# EAGLE board EXCISS Mainboard (EAGLE 7.7.0)
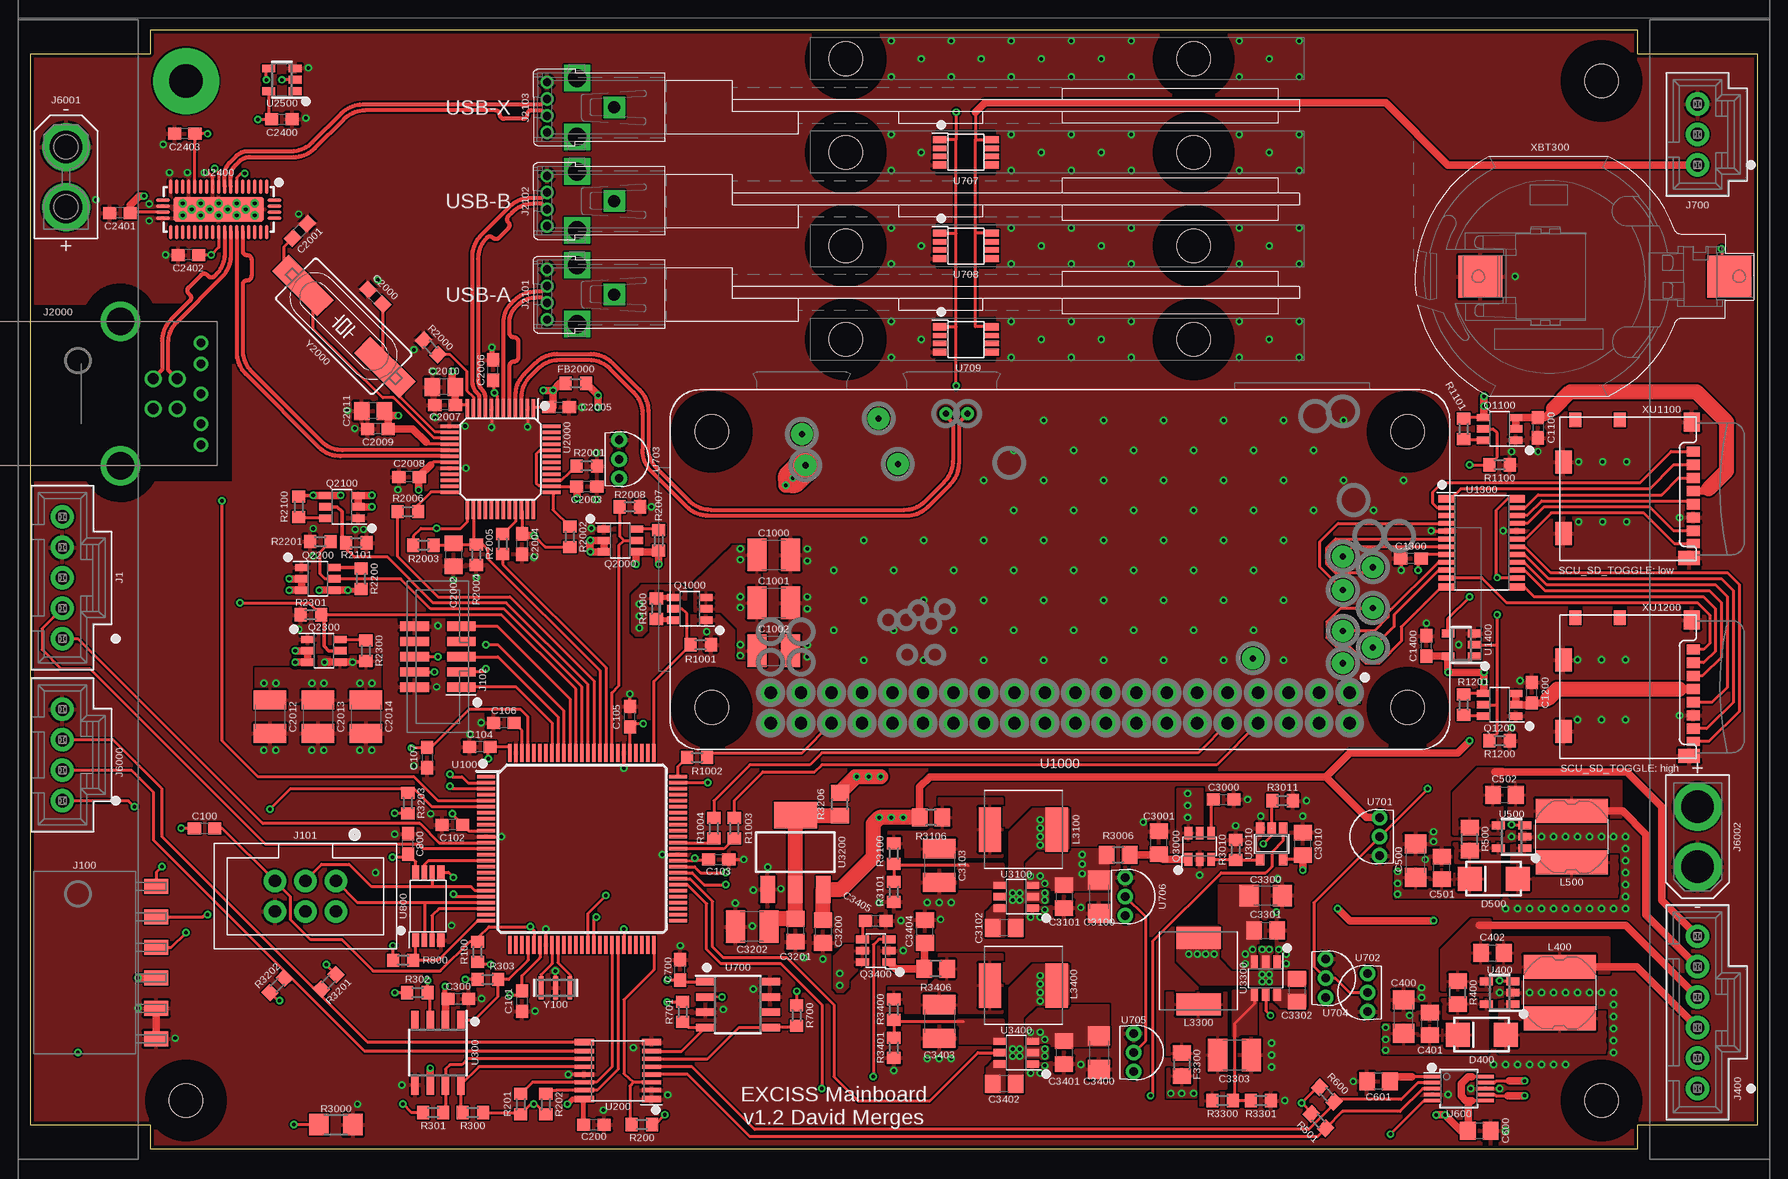
[diagram p5: board, top side]
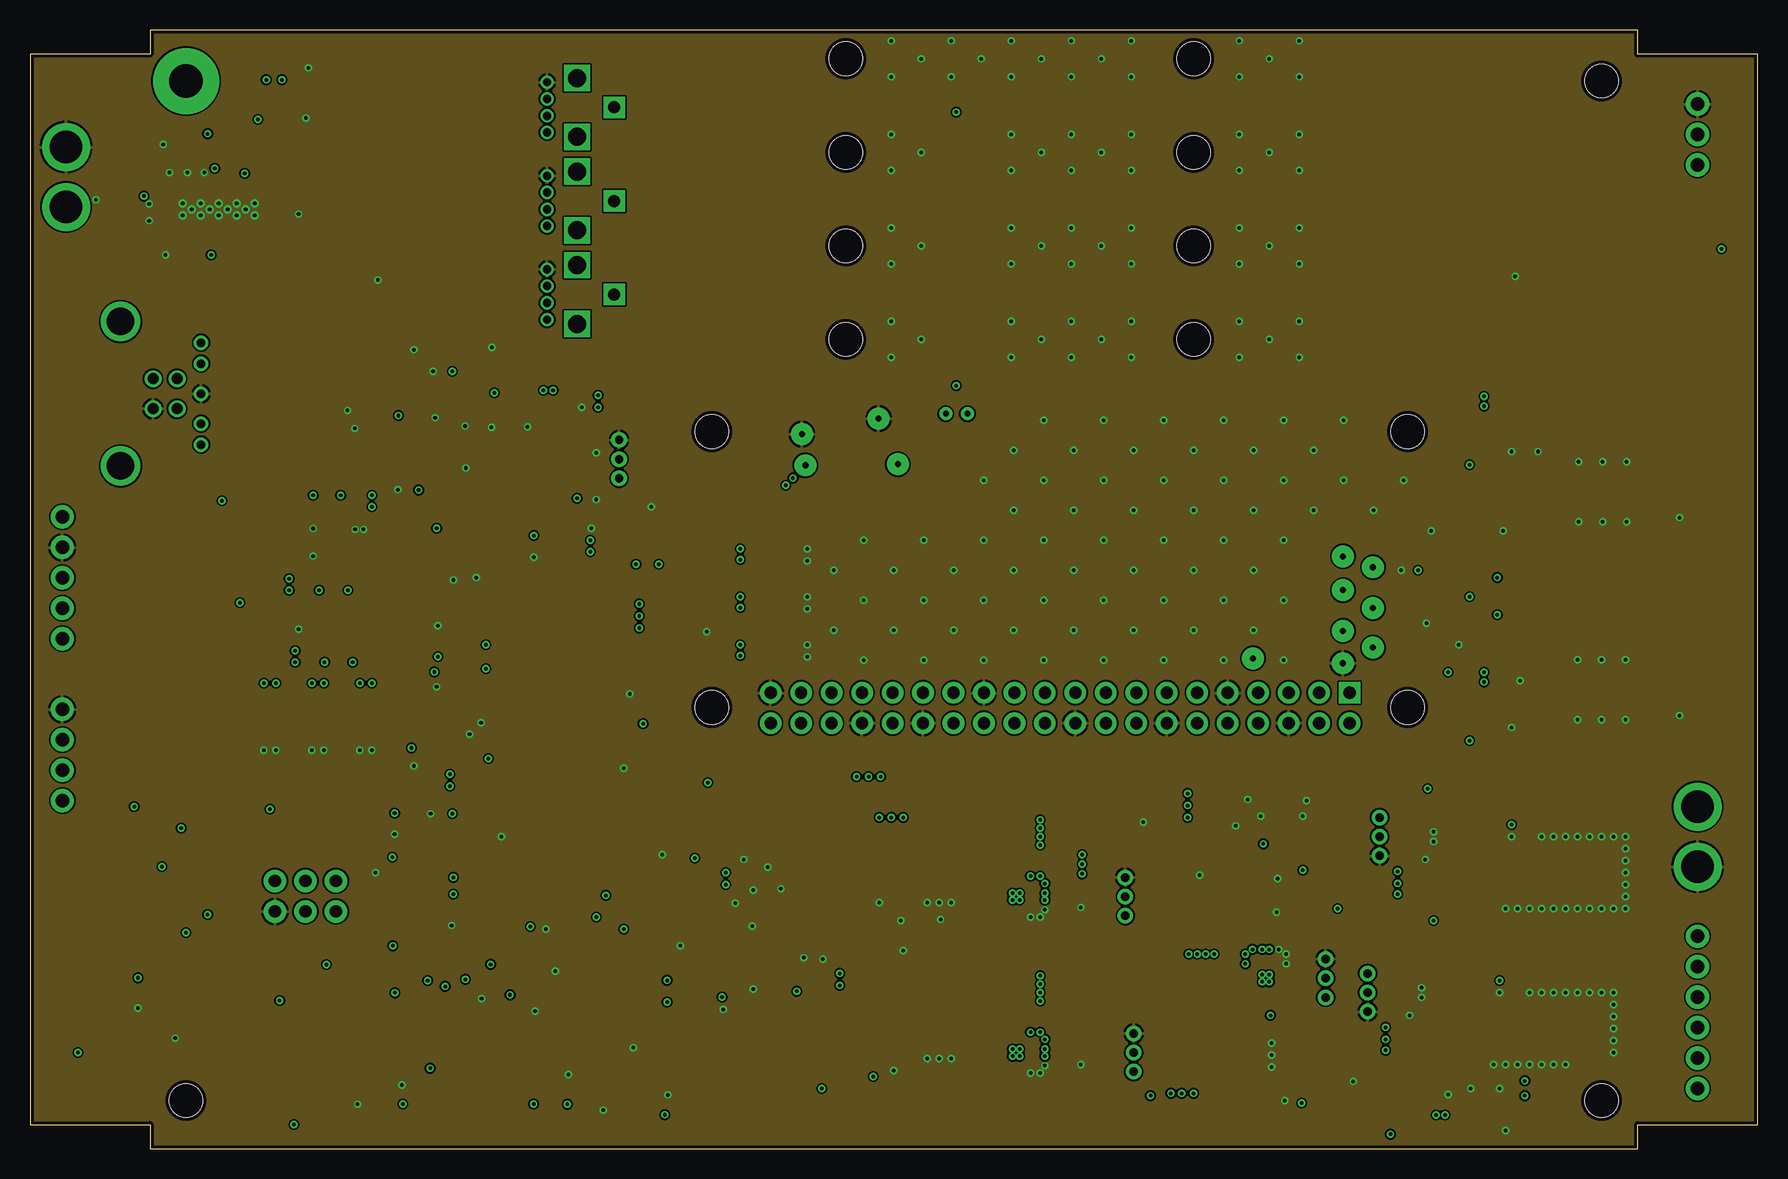
[diagram p6: board, inner layer GND]
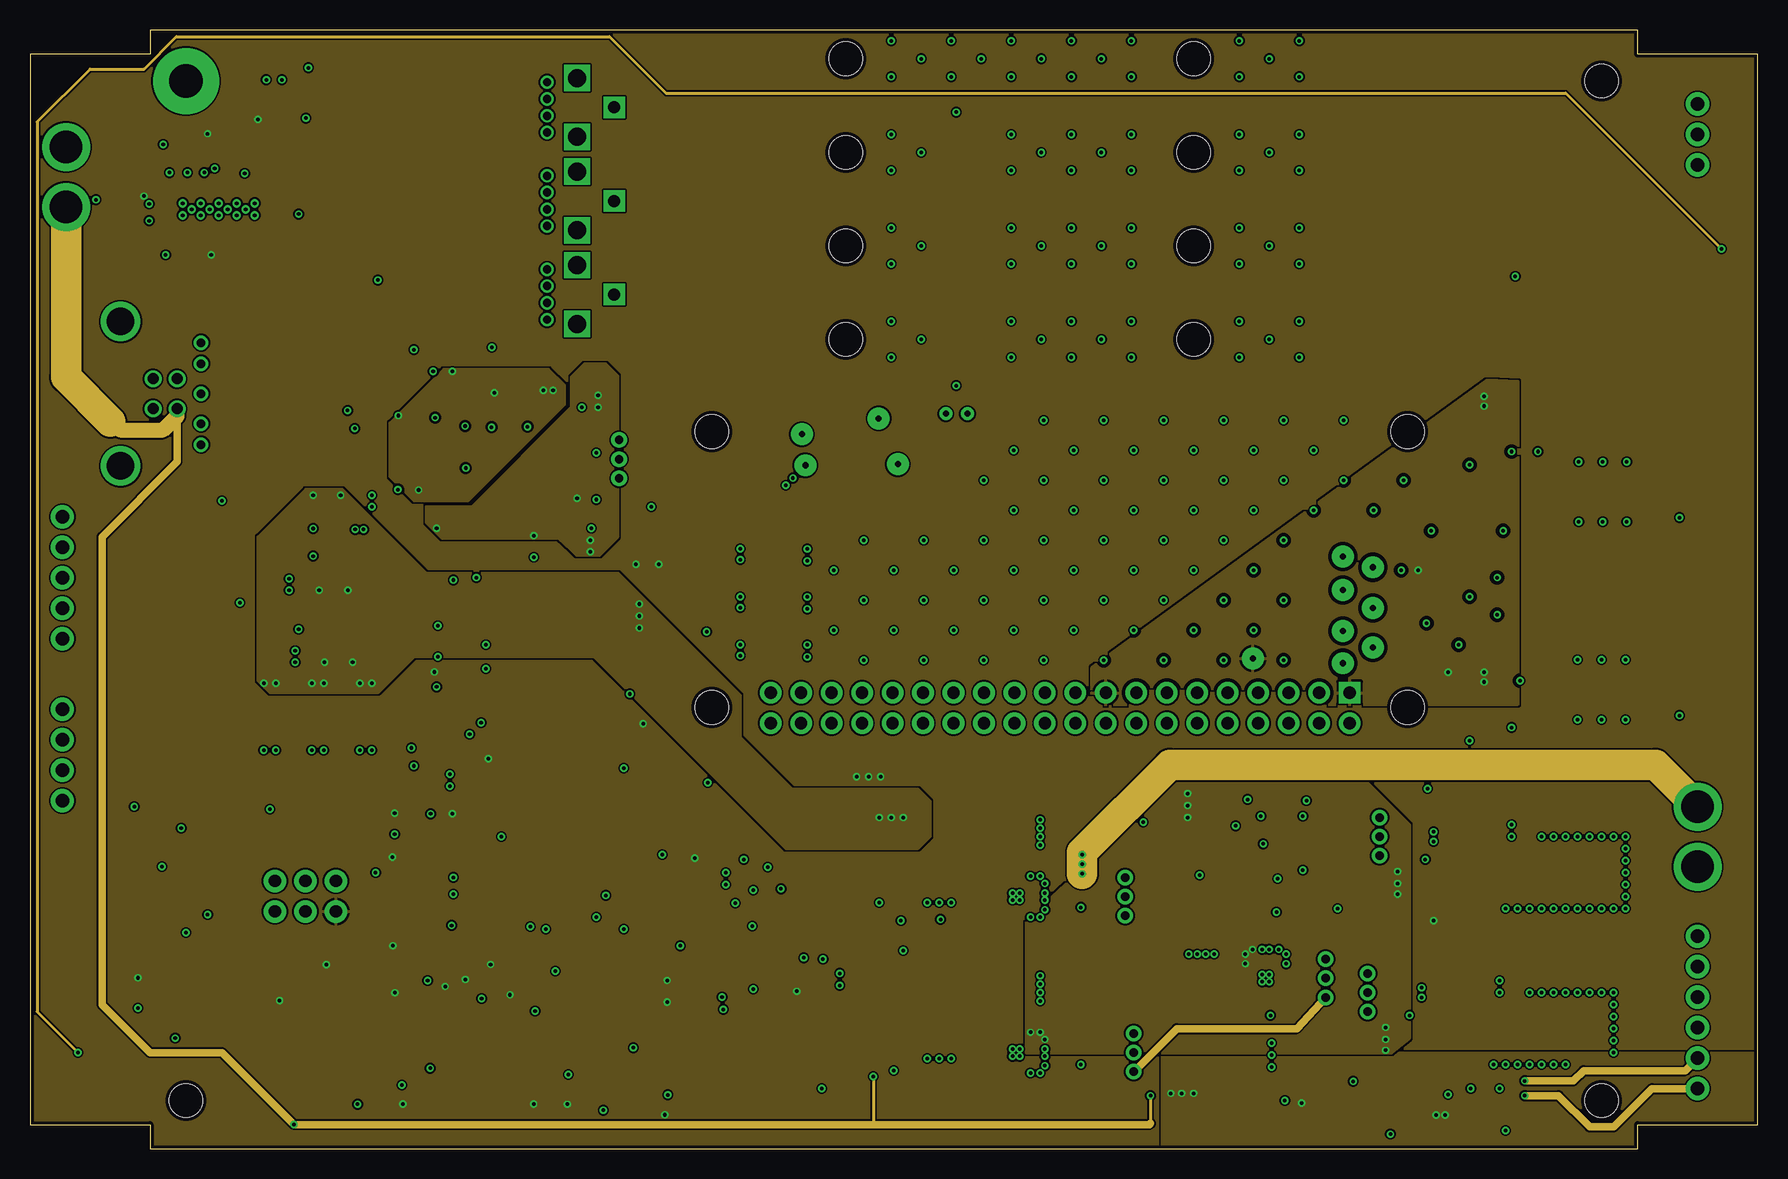
[diagram p7: board, inner layer VCC]
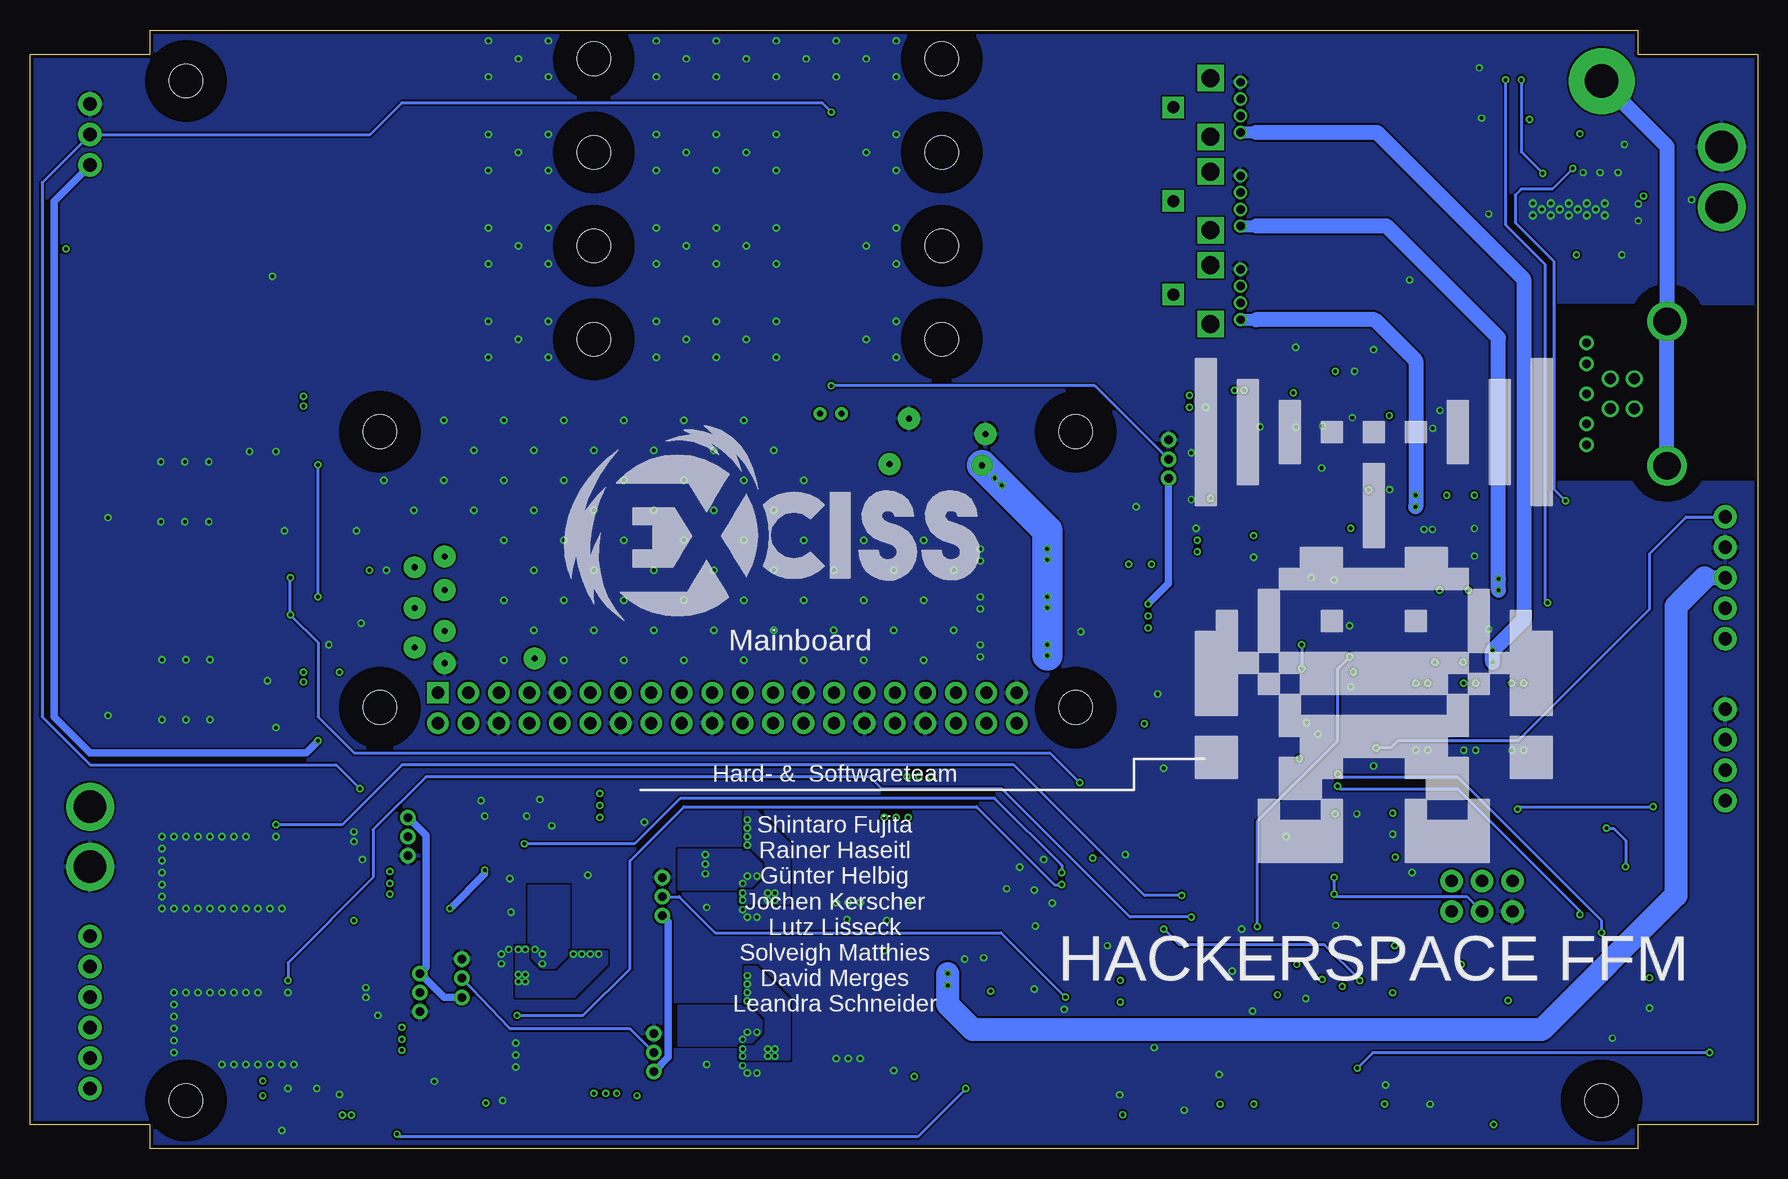
[diagram p8: board, bottom side, seen from below]

Size 144 x 93.25 mm. Coordinates in mm from the lower left corner, seen from the top.
Outline: 0,2 10,2 10,0 134,0 134,2 144,2 144,91.25 134,91.25 134,93.25 10,93.25 10,91.25 0,91.25 0,2
Copper layers (1+2*15+16): Top 0.035mm / dielectric 0.38mm / GND 0.035mm / dielectric 0.71mm / VCC 0.035mm / dielectric 0.38mm / Bottom 0.035mm
Design rules "PCB-POOL Standard_ML4 *": minimum track width 0.15mm, minimum drill 0.3mm, track to track 0.15mm, track to pad 0.15mm, pad to pad 0.15mm, via to via 0.15mm, smd to smd 0.15mm, copper to edge 0.3mm, drill to drill 0.2mm, minimum pad ring 0.2mm, minimum via ring 0.15mm, stop-mask expansion 0.075mm, vias tented up to drill 0.3mm, thermal gap 0.2mm
Net classes: 1 diff.pair: width 0.34 mm, clearance 1 mm to class 0, clearance 0.15 mm; 2 chassis connection: clearance 1 mm

## Footprints (pad centres in the part's own frame; a part is rotated, then mirrored left to right if it is on the bottom)
C0603 = smd 1.1 x 1: 1 -0.85,0; 2 0.85,0
C1206 = smd 1.6 x 1.8: 1 -1.4,0; 2 1.4,0
C0805 = smd 1.3 x 1.5: 1 -0.95,0; 2 0.95,0
C1210 = smd 1.6 x 2.7: 1 -1.4,0; 2 1.4,0
PAD_M2.5 = drill 2.8 pad 5.5: P$1 0,0
403D-02 = smd 2 x 2: A -2,0; C 2,0
R0805_NOCREAM = smd 1.3 x 1.5: 1 -0.95,0; 2 0.95,0
0603 = smd 1 x 1.1: 1 -0.85,0; 2 0.85,0
MOLEX_70543-0004 = drill 1.1 pad 1.93: 1 0,0; 2 0,-2.54; 3 0,-5.08; 4 0,-7.62; 5 0,-10.16
MPE_094-1-006 = smd 2.032 x 1.27: 1 10.223,-6.35; 2 10.223,-3.81; 3 10.223,-1.27; 4 10.223,1.27; 5 10.223,3.81; 6 10.223,6.35
ISP-M-THT = drill 1.016 pad 1.88: 1 0,0; 2 2.54,0; 3 0,-2.54; 4 2.54,-2.54; 5 0,-5.08; 6 2.54,-5.08
20021521-00010T1LF = smd 2.4 x 0.76: 1 -1.95,2.54; 2 1.95,2.54; 3 -1.95,1.27; 4 1.95,1.27; 5 -1.95,0; 6 1.95,0; 7 -1.95,-1.27; 8 1.95,-1.27; 9 -1.95,-2.54; 10 1.95,-2.54
MOLEX_70543-0005 = drill 1.1 pad 1.93: 1 0,0; 2 0,-2.54; 3 0,-5.08; 4 0,-7.62; 5 0,-10.16; 6 0,-12.7
MOLEX_70543-0002 = drill 1.1 pad 1.93: 1 0,0; 2 0,-2.54; 3 0,-5.08
GSB3211311WEU = drill 0.92 pad 1.4: 1 13.26,62.675; 2 13.26,65.175; 3 11.26,65.175; 4 11.26,62.675 | drill 0.7 pad 1.2: 5 15.26,68.175; 6 15.26,66.425; 7 15.26,63.925; 8 15.26,61.425; 9 15.26,59.675 | drill 2.3 pad 3.3: SHIELD_1 8.55,69.945; SHIELD_2 8.55,57.905
614004184726 = drill 0.7: 1 -2.1,9.9; 2 -0.7,9.9; 3 0.7,9.9; 4 2.1,9.9 | drill 1.5 pad 2.2 square: SHIELD_1 -2.45,7.4; SHIELD_2 2.45,7.4 | drill 1 pad 1.8 square: SHIELD_3 0,4.3
MOLEX_70543-0003 = drill 1.1 pad 1.93: 1 0,0; 2 0,-2.54; 3 0,-5.08; 4 0,-7.62
XT30-F = drill 2.7 pad 4: + 0,-2.5; - 0,2.5
XT30-M = drill 2.7 pad 4: + 0,-2.5; - 0,2.5
SRN6045 = smd 2 x 6: 1 -2.15,0; 2 2.15,0
SRP6540 = smd 1.85 x 3.7: 1 -2.775,0; 2 2.775,0
DDC(R-PDSO-G6) = smd 1.1 x 0.6: 1 -1.35,0.95; 2 -1.35,0; 3 -1.35,-0.95; 4 1.35,-0.95; 5 1.35,0; 6 1.35,0.95
SOT23-6_DBV = smd 1.06 x 0.65: 1 -1.1,0.95; 2 -1.1,0; 3 -1.1,-0.95; 4 1.1,-0.95; 5 1.1,0; 6 1.1,0.95
R0603 = smd 1 x 1.1: 1 -0.85,0; 2 0.85,0
R0805 = smd 1.3 x 1.5: 1 -0.95,0; 2 0.95,0
R1206 = smd 1.6 x 1.803: 1 -1.422,0; 2 1.422,0
TQFP100 = smd 1.5 x 0.3: 1 -8,6; 2 -8,5.5; 3 -8,5; 4 -8,4.5; 5 -8,4; 6 -8,3.5; 7 -8,3; 8 -8,2.5; 9 -8,2; 10 -8,1.5; 11 -8,1; 12 -8,0.5; 13 -8,0; 14 -8,-0.5; 15 -8,-1; 16 -8,-1.5; 17 -8,-2; 18 -8,-2.5; 19 -8,-3; 20 -8,-3.5; 21 -8,-4; 22 -8,-4.5; 23 -8,-5; 24 -8,-5.5; 25 -8,-6; 51 8,-6; 52 8,-5.5; 53 8,-5; 54 8,-4.5; 55 8,-4; 56 8,-3.5; 57 8,-3; 58 8,-2.5; 59 8,-2; 60 8,-1.5; 61 8,-1; 62 8,-0.5; 63 8,0; 64 8,0.5; 65 8,1; 66 8,1.5; 67 8,2; 68 8,2.5; 69 8,3; 70 8,3.5; 71 8,4; 72 8,4.5; 73 8,5; 74 8,5.5; 75 8,6 | smd 0.3 x 1.5: 26 -6,-8; 27 -5.5,-8; 28 -5,-8; 29 -4.5,-8; 30 -4,-8; 31 -3.5,-8; 32 -3,-8; 33 -2.5,-8; 34 -2,-8; 35 -1.5,-8; 36 -1,-8; 37 -0.5,-8; 38 0,-8; 39 0.5,-8; 40 1,-8; 41 1.5,-8; 42 2,-8; 43 2.5,-8; 44 3,-8; 45 3.5,-8; 46 4,-8; 47 4.5,-8; 48 5,-8; 49 5.5,-8; 50 6,-8; 76 6,8; 77 5.5,8; 78 5,8; 79 4.5,8; 80 4,8; 81 3.5,8; 82 3,8; 83 2.5,8; 84 2,8; 85 1.5,8; 86 1,8; 87 0.5,8; 88 0,8; 89 -0.5,8; 90 -1,8; 91 -1.5,8; 92 -2,8; 93 -2.5,8; 94 -3,8; 95 -3.5,8; 96 -4,8; 97 -4.5,8; 98 -5,8; 99 -5.5,8; 100 -6,8
R-PDSO-G16 = smd 1.6 x 0.55: 1 -2.8,2.375; 8 -2.8,-2.375; 9 2.8,-2.375; 16 2.8,2.375 | smd 1.6 x 0.35: 2 -2.8,1.625; 3 -2.8,0.975; 4 -2.8,0.325; 5 -2.8,-0.325; 6 -2.8,-0.975; 7 -2.8,-1.625; 10 2.8,-1.625; 11 2.8,-0.975; 12 2.8,-0.325; 13 2.8,0.325; 14 2.8,0.975; 15 2.8,1.625
SOIC8 = smd 1.6 x 0.61: 1 -2.7,1.905; 2 -2.7,0.635; 3 -2.7,-0.635; 4 -2.7,-1.905; 5 2.7,-1.905; 6 2.7,-0.635; 7 2.7,0.635; 8 2.7,1.905
DBV(R-PDSO-G5) = smd 1.06 x 0.65: 1 -1.1,0.95; 2 -1.1,0; 3 -1.1,-0.95; 4 1.1,-0.95; 5 1.1,0.95
PSOP10 = smd 1.45 x 0.28: 1 -2.2,1; 2 -2.2,0.5; 3 -2.2,0; 4 -2.2,-0.5; 5 -2.2,-1; 6 2.2,-1; 7 2.2,-0.5; 8 2.2,0; 9 2.2,0.5; 10 2.2,1
TO-92-STRAIGHT = drill 0.7 pad 1.3: 1 -1.6,0; 2 0,0; 3 1.6,0
µSOP = smd 1.15 x 0.6: 1 -2.175,1.058; 4 -2.175,-1.058; 5 2.175,-1.058; 8 2.175,1.058 | smd 1.15 x 0.45: 2 -2.175,0.325; 3 -2.175,-0.325; 6 2.175,-0.325; 7 2.175,0.325
TSSOP8 = smd 1.15 x 0.6: 1 -2.825,1.052; 4 -2.825,-1.052; 5 2.825,-1.052; 8 2.825,1.052 | smd 1.15 x 0.45: 2 -2.825,0.318; 3 -2.825,-0.318; 6 2.825,-0.318; 7 2.825,0.318
RASPBERRY_PI_ZERO_W_V1.1 = drill 1.02 pad 1.8 square: 1 0,0 | drill 1.02 pad 1.8: 2 0,2.54; 3 2.54,0; 4 2.54,2.54; 5 5.08,0; 6 5.08,2.54; 7 7.62,0; 8 7.62,2.54; 9 10.16,0; 10 10.16,2.54; 11 12.7,0; 12 12.7,2.54; 13 15.24,0; 14 15.24,2.54; 15 17.78,0; 16 17.78,2.54; 17 20.32,0; 18 20.32,2.54; 19 22.86,0; 20 22.86,2.54; 21 25.4,0; 22 25.4,2.54; 23 27.94,0; 24 27.94,2.54; 25 30.48,0; 26 30.48,2.54; 27 33.02,0; 28 33.02,2.54; 29 35.56,0; 30 35.56,2.54; 31 38.1,0; 32 38.1,2.54; 33 40.64,0; 34 40.64,2.54; 35 43.18,0; 36 43.18,2.54; 37 45.72,0; 38 45.72,2.54; 39 48.26,0; 40 48.26,2.54 | drill 0.508 pad 1.829: PP1 45.36,-18.96; PP5 0.56,-2.46; PP6 45.66,-21.56; PP8 8.06,-2.86; PP14 -1.94,-7.06; PP15 0.56,-11.36; PP16 0.56,-5.16; PP17 -1.94,-3.76; PP18 0.56,-8.56; PP19 -1.94,-10.46; PP35 39.26,-22.86; PP40 37.66,-19.06 | drill 0.5 pad 1.092: PP22 33.66,-23.26; PP23 31.86,-23.26 | hole 2.8: 53.16,1.24; 53.16,-21.76; -4.84,-21.76; -4.84,1.24
TSSOP24 = smd 1.35 x 0.6: 1 -2.925,3.675; 12 -2.925,-3.675; 13 2.925,-3.675; 24 2.925,3.675 | smd 1.35 x 0.4: 2 -2.925,2.925; 3 -2.925,2.275; 4 -2.925,1.625; 5 -2.925,0.975; 6 -2.925,0.325; 7 -2.925,-0.325; 8 -2.925,-0.975; 9 -2.925,-1.625; 10 -2.925,-2.275; 11 -2.925,-2.925; 14 2.925,-2.925; 15 2.925,-2.275; 16 2.925,-1.625; 17 2.925,-0.975; 18 2.925,-0.325; 19 2.925,0.325; 20 2.925,0.975; 21 2.925,1.625; 22 2.925,2.275; 23 2.925,2.925
TQFP48 = smd 1.5 x 0.3: 1 -4.25,2.75; 2 -4.25,2.25; 3 -4.25,1.75; 4 -4.25,1.25; 5 -4.25,0.75; 6 -4.25,0.25; 7 -4.25,-0.25; 8 -4.25,-0.75; 9 -4.25,-1.25; 10 -4.25,-1.75; 11 -4.25,-2.25; 12 -4.25,-2.75; 25 4.25,-2.75; 26 4.25,-2.25; 27 4.25,-1.75; 28 4.25,-1.25; 29 4.25,-0.75; 30 4.25,-0.25; 31 4.25,0.25; 32 4.25,0.75; 33 4.25,1.25; 34 4.25,1.75; 35 4.25,2.25; 36 4.25,2.75 | smd 0.3 x 1.5: 13 -2.75,-4.25; 14 -2.25,-4.25; 15 -1.75,-4.25; 16 -1.25,-4.25; 17 -0.75,-4.25; 18 -0.25,-4.25; 19 0.25,-4.25; 20 0.75,-4.25; 21 1.25,-4.25; 22 1.75,-4.25; 23 2.25,-4.25; 24 2.75,-4.25; 37 2.75,4.25; 38 2.25,4.25; 39 1.75,4.25; 40 1.25,4.25; 41 0.75,4.25; 42 0.25,4.25; 43 -0.25,4.25; 44 -0.75,4.25; 45 -1.25,4.25; 46 -1.75,4.25; 47 -2.25,4.25; 48 -2.75,4.25
RUA(R-PWQFN-N42) = smd 1.2 x 0.3: 1 -1.9,4; 2 -1.9,3.5; 3 -1.9,3; 4 -1.9,2.5; 5 -1.9,2; 6 -1.9,1.5; 7 -1.9,1; 8 -1.9,0.5; 9 -1.9,0; 10 -1.9,-0.5; 11 -1.9,-1; 12 -1.9,-1.5; 13 -1.9,-2; 14 -1.9,-2.5; 15 -1.9,-3; 16 -1.9,-3.5; 17 -1.9,-4; 22 1.9,-4; 23 1.9,-3.5; 24 1.9,-3; 25 1.9,-2.5; 26 1.9,-2; 27 1.9,-1.5; 28 1.9,-1; 29 1.9,-0.5; 30 1.9,0; 31 1.9,0.5; 32 1.9,1; 33 1.9,1.5; 34 1.9,2; 35 1.9,2.5; 36 1.9,3; 37 1.9,3.5; 38 1.9,4 | smd 0.3 x 1.2: 18 -0.75,-4.65; 19 -0.25,-4.65; 20 0.25,-4.65; 21 0.75,-4.65; 39 0.75,4.65; 40 0.25,4.65; 41 -0.25,4.65; 42 -0.75,4.65 | smd 2.05 x 7.55: TP0 0,0 | drill 0.3: TP1 0.5,3; TP2 0.5,1.5; TP3 0.5,0; TP4 0.5,-1.5; TP5 0.5,-3; TP6 0,2.25; TP7 0,0.75; TP8 0,-0.75; TP9 0,-2.25; TP10 -0.5,3; TP11 -0.5,1.5; TP12 -0.5,0; TP13 -0.5,-1.5; TP14 -0.5,-3
SOT23-5 = smd 0.69 x 0.99: 1 -0.95,-1.29; 2 0,-1.29; 3 0.95,-1.29; 4 0.95,1.3; 5 -0.95,1.3
SOT223 = smd 1.219 x 2.235: 1 -2.311,-3.099; 2 0,-3.099; 3 2.311,-3.099 | smd 3.6 x 2.2: 4 0,3.099
KINGSTON_USB_TRIPLE = hole 2.8: 15,4.05; 15,-3.75; 15,11.85; 15,-11.55; 44,4.05; 44,-3.75; 44,11.85; 44,-11.55
DRILL_M2.5 = hole 2.8: 0,0
KEYSTONE_1070 = smd 3.65 x 3.51: + -20.75,0; - 0,0
MICROSD_MOLEX_104031 = smd 0.85 x 1.1: 1 -3.105,-0.85; 2 -2.005,-0.85; 3 -0.905,-0.85; 4 0.195,-0.85; 5 1.295,-0.85; 6 2.395,-0.85; 7 3.495,-0.85 | smd 0.75 x 1.1: 8 4.545,-0.85 | smd 1.2 x 1: DET_A -5.74,-7; DET_B -5.74,-10.7 | smd 1.55 x 1.35: G1 -5.565,-0.975 | smd 1.17 x 1.8: G2 5.755,-1.2 | smd 1.9 x 1.35: G3 3.73,-11.675; G4 -2.24,-11.675
CSTNE = smd 0.4 x 1.9: 1 -1.2,0; 2 0,0; 3 1.2,0
HC49UP = smd 5.334 x 1.93: 1 -4.826,0; 2 4.826,0

## Placement (x,y rotation side)
C100  100nF  [C0603]  14.55,26.7 0 top
C101  100nF  [C0603]  41,12.3 270 top
C102  100nF  [C0603]  35.2,27 180 top
C103  100nF  [C0603]  57.4,24.1 0 top
C104  100nF  [C0603]  37.5,33.5 180 top
C105  100nF  [C0603]  50,36 90 top
C106  100nF  [C0603]  39.5,35.5 180 top
C107  100nF  [C0603]  33.1,32.6 270 top
C200  100nF  [C0603]  47,2 0 top
C300  100nF  [C0603]  35.7,12.5 0 top
C400  2,2µF  [C1206]  114.5,11 90 top
C401  100nF  [C0805]  116.7,10.4 90 top
C402  1µF  [C0805]  121.9,16.3 0 top
C500  2,2µF  [C1206]  115.5,24 90 top
C501  100nF  [C0805]  117.7,23.4 90 top
C502  1µF  [C0805]  122.9,29.5 0 top
C600  1µF  [C0805]  120.8,1.5 0 top
C601  1µF  [C0805]  112.4,5.6 180 top
C700  100nF  [C0603]  54.2,14.9 90 top
C800  100nF  [C0603]  31.5,25.4 90 top
C1000  47µF  [C1210]  62,49.5 0 top
C1001  47µF  [C1210]  62,45.5 0 top
C1002  47µF  [C1210]  62,41.5 0 top
C1100  100nF  [C0603]  125.7,60.1 270 top
C1200  100nF  [C0603]  125.2,38 90 top
C1300  100nF  [C0603]  115.1,49.2 180 top
C1400  100nF  [C0603]  116.4,41.9 90 top
C2000  20pF  [C0603]  28.8,71 135 top
C2001  20pF  [C0603]  22.5,76.5 45 top
C2002  1µF  [C0805]  35.3,49.5 270 top
C2003  100nF  [C0603]  46.4,55.2 0 top
C2004  100nF  [C0603]  41,50.4 270 top
C2005  100nF  [C0603]  44.1,61.8 0 top
C2006  100nF  [C0603]  38.62,64.9 90 top
C2007  100nF  [C0603]  34.6,62 180 top
C2008  100nF  [C0603]  31.6,56 180 top
C2009  100nF  [C0603]  29,60 180 top
C2010  1µF  [C0805]  34.5,63.5 180 top
C2011  1µF  [C0805]  28.6,61.5 180 top
C2012  47µF  [C1210]  20,36 270 top
C2013  47µF  [C1210]  24,36 270 top
C2014  47µF  [C1210]  28,36 270 top
C2400  100nF  [C0603]  21,85.8 0 top
C2401  100nF  [C0603]  7.5,78 180 top
C2402  100nF  [C0603]  13.2,74.5 180 top
C2403  100nF  [C0603]  12.9,84.6 180 top
C3000  10nF  [C0603]  99.5,29.1 0 top
C3001  1µF  [C0805]  94.1,25.5 90 top
C3010  100nF  [C0805]  106.1,25.4 90 top
C3100  22µF  [C1206]  89.1,21 270 top
C3101  100nF  [C0805]  86.2,21 270 top
C3102  100nF  [C0805]  81.2,18.4 180 top
C3103  47µF  [C1210]  75.8,23.6 270 top
C3200  1µF  [C0805]  66.1,18.1 270 top
C3201  1µF  [C0805]  63.8,18.2 270 top
C3202  47µF  [C1210]  60.2,18.5 180 top
C3300  22µF  [C1206]  103,21.1 0 top
C3301  100nF  [C0805]  103,18.2 0 top
C3302  100nF  [C0805]  105.6,13.2 270 top
C3303  47µF  [C1210]  100.4,7.8 0 top
C3400  22µF  [C1206]  89.1,8 270 top
C3401  100nF  [C0805]  86.2,8 270 top
C3402  100nF  [C0805]  81.2,5.4 180 top
C3403  47µF  [C1210]  75.8,10.6 270 top
C3404  1µF  [C0805]  74.6,18.1 90 top
C3405  10nF  [C0603]  70.5,19 0 top
CHASSIS  [PAD_M2.5]  13,89 0 top
D400  MBRA140T3G  [403D-02]  121,9.5 180 top
D500  MBRA140T3G  [403D-02]  122,22.5 180 top
F3300  350mA  [R0805_NOCREAM]  96,7 270 top
FB2000  BLM18HG601SN1  [0603]  45.5,63.8 180 top
J1  70543-0004  [MOLEX_70543-0004]  2.7,42.5 180 top
J100  FTDI-M-INV  [MPE_094-1-006]  0.3,15.5 0 top
J101  ISP-M_WSL  [ISP-M-THT]  25.5,22.3 270 top
J102  JTAG  [20021521-00010T1LF]  34,41 180 top
J400  70543-0005  [MOLEX_70543-0005]  139,5 180 top
J700  70543-0002  [MOLEX_70543-0002]  139,82 180 top
J2000  GSB3211311WEU  [GSB3211311WEU]  -1,-1 0 top
J2101  614004184726  [614004184726]  53,71.2 90 top
J2102  614004184726  [614004184726]  53,79 90 top
J2103  614004184726  [614004184726]  53,86.8 90 top
J6000  70543-0003  [MOLEX_70543-0003]  2.7,29 180 top
J6001  XT30-F  [XT30-F]  3,81 0 top
J6002  XT30-M  [XT30-M]  139,26 180 top
L400  33µH  [SRN6045]  127.5,13 90 top
L500  33µH  [SRN6045]  128.5,26 90 top
L3100  8.2µH  [SRP6540]  82.8,26.6 180 top
L3300  8.2µH  [SRP6540]  97.4,14.8 270 top
L3400  8.2µH  [SRP6540]  82.8,13.6 180 top
Q1000  TPS27081ADDC  [DDC(R-PDSO-G6)]  55,45 180 top
Q1100  TPS27081ADDC  [DDC(R-PDSO-G6)]  122.5,60 180 top
Q1200  TPS27081ADDC  [DDC(R-PDSO-G6)]  122.5,37 180 top
Q2000  TPS27081ADDC  [DDC(R-PDSO-G6)]  49.2,50.7 0 top
Q2100  TPS27081ADDC  [DDC(R-PDSO-G6)]  26,53.5 180 top
Q2200  TPS27081ADDC  [DDC(R-PDSO-G6)]  24,47.5 0 top
Q2300  TPS27081ADDC  [DDC(R-PDSO-G6)]  24.5,41.5 0 top
Q3000  TPS22810DBV  [SOT23-6_DBV]  97.5,25.2 90 top
Q3400  TPS22810DBV  [SOT23-6_DBV]  70.5,16.5 180 top
R100  10K  [R0603]  37.3,16.4 90 top
R200  10K  [R0603]  51,2 180 top
R201  10K  [R0603]  40.9,3.7 90 top
R202  10K  [R0603]  43,3.7 90 top
R300  10K  [R0603]  36.9,3 180 top
R301  10K  [R0603]  33.6,3 0 top
R302  10K  [R0603]  32.3,13 0 top
R303  10K  [R0603]  38.15,14.1 0 top
R400  0.3R  [R0805]  119,13 90 top
R500  0.3R  [R0805]  120,25.8 90 top
R501  10K  [R0603]  107.4,2.3 315 top
R600  10K  [R0603]  108.1,4.5 315 top
R700  10K  [R0603]  63.9,11.1 270 top
R701  10K  [R0603]  54.4,11.4 270 top
R800  10K  [R0603]  31.1,15.7 180 top
R1000  10K  [R0603]  52.2,45 90 top
R1001  10K  [R0603]  55.9,42 180 top
R1002  1K  [R0603]  55.6,32.6 180 top
R1003  1K  [R0603]  58.7,26.7 270 top
R1004  1K  [R0603]  57,26.7 270 top
R1100  10K  [R0603]  122.5,57 180 top
R1101  10K  [R0603]  119.5,60 90 top
R1200  10K  [R0603]  122.5,34 180 top
R1201  10K  [R0603]  119.5,37 90 top
R2000  650R 1%  [R0603]  33.4,66.8 315 top
R2001  100K  [R0603]  46.4,56.9 180 top
R2002  100K  [R0603]  45,51 90 top
R2003  10K  [R0603]  32.8,50.3 180 top
R2004  47K  [R0603]  37.2,49.5 90 top
R2005  10K  [R0603]  39.4,50.4 90 top
R2006  10K  [R0603]  31.5,53.1 0 top
R2007  10K  [R0603]  52.4,50.7 270 top
R2008  10K  [R0603]  50,53.5 180 top
R2100  10K  [R0603]  22.4,53.5 90 top
R2101  10K  [R0603]  27.2,50.5 180 top
R2200  10K  [R0603]  27.6,47.5 270 top
R2201  10K  [R0603]  24.2,50.6 0 top
R2300  10K  [R0603]  28,41.5 270 top
R2301  10K  [R0603]  23.4,44.5 0 top
R3000  10K  [R1206]  25.5,2 180 top
R3006  0R  [R0805_NOCREAM]  90.7,24.5 0 top
R3010  10K  [R0603]  100.5,24.9 270 top
R3011  10K  [R0603]  104.4,29 180 top
R3100  100K  [R0603]  72,24.6 90 top
R3101  13K3  [R0603]  72,21.4 90 top
R3106  0R  [R0805_NOCREAM]  75.1,27.6 180 top
R3201  10K  [R0603]  24.9,13.9 225 top
R3202  10K  [R0603]  20.6,13.6 45 top
R3203  10K  [R0603]  31.5,28.8 90 top
R3206  0R  [R0805_NOCREAM]  67.5,28.7 90 top
R3300  100K  [R0603]  99.4,4 180 top
R3301  22K  [R0603]  102.6,4 180 top
R3400  100K  [R0603]  72,11.6 90 top
R3401  5K23  [R0603]  72,8.4 90 top
R3406  0R  [R0805_NOCREAM]  75.5,15 180 top
U100  ATMEGA2560V  [TQFP100]  46,25 0 top
U200  PCA9546APW  [R-PDSO-G16]  49,6.5 180 top
U300  DS3231MZ+  [SOIC8]  34,8 270 top
U400  AL8805  [DBV(R-PDSO-G5)]  122.5,13 180 top
U500  AL8805  [DBV(R-PDSO-G5)]  123.5,26 180 top
U600  DRV2605LTDGS  [PSOP10]  119.1,5 0 top
U700  DS2482S-100+  [SOIC8]  59,12 0 top
U701  DS18B20+  [TO-92-STRAIGHT]  112.5,26 90 top
U702  DS18B20+  [TO-92-STRAIGHT]  111.5,13 90 top
U703  DS18B20+  [TO-92-STRAIGHT]  49.1,57.47 270 top
U704  DS18B20+  [TO-92-STRAIGHT]  108,14.2 270 top
U705  DS18B20+  [TO-92-STRAIGHT]  92,8 270 top
U706  DS18B20+  [TO-92-STRAIGHT]  91.3,21 270 top
U707  DS18B20U+  [µSOP]  78,83.05 0 top
U708  DS18B20U+  [µSOP]  78,75.25 0 top
U709  DS18B20U+  [µSOP]  78,67.45 0 top
U800  M95512-DRDW8TP/K  [TSSOP8]  33.2,20.2 90 top
U1000  RASPBERRY_PI_ZERO_W_V1.1  [RASPBERRY_PI_ZERO_W_V1.1]  110,38 180 top
U1300  TS3A27518E  [TSSOP24]  121,50.5 0 top
U1400  74LVC1G04DBV  [DBV(R-PDSO-G5)]  119.3,42 180 top
U2000  CY7C65632-48AXCT  [TQFP48]  39.22,57.47 270 top
U2400  HD3SS6126RUA  [RUA(R-PWQFN-N42)]  15.73,78.3 270 top
U2500  74LVC1G04DBV  [DBV(R-PDSO-G5)]  21,89.1 180 top
U3010  74LVC1G08DBV  [SOT23-5]  103.5,25.4 180 top
U3100  TPS54308DDC  [DDC(R-PDSO-G6)]  82.2,21 180 top
U3200  AZ1117EH-3.3V  [SOT223]  63.8,24.7 0 top
U3300  TPS54308DDC  [DDC(R-PDSO-G6)]  103,14.2 270 top
U3400  TPS54308DDC  [DDC(R-PDSO-G6)]  82.2,8 180 top
U$1  [KINGSTON_USB_TRIPLE]  53,79 0 top
U$3  [NANOLAB_1.5U]  -1,-1 0 top
U$4  [NANOLAB_1.5U_LIDS]  -1,-1 0 top
U$15  [LOGO_EXCISS]  79.8,51 0 bottom
U$16  [DRILL_M2.5]  131,89 0 top
U$17  [DRILL_M2.5]  131,4 0 top
U$18  [DRILL_M2.5]  13,4 0 top
U$19  [LOGO_HACKFFM]  32,44 0 bottom
XBT300  KEYSTONE_1070  [KEYSTONE_1070]  120.9,72.7 180 top
XU1100  MICROSDMOLEX_104031  [MICROSD_MOLEX_104031]  139.5,55 270 top
XU1200  MICROSDMOLEX_104031  [MICROSD_MOLEX_104031]  139.5,38.5 270 top
Y100  8Mhz  [CSTNE]  43.8,13.4 0 top
Y2000  12MHz  [HC49UP]  26.16,68.54 135 top

## Tracks (layer width: path | path; a pad name or v marks a point on that pad's centre or on a via)
1-WIRE  (via drill 0.3)
  Top 0.254: U705.2 93,9 93,19.3 U706.2 | v116.5,30 U701.2 107,20.5 107,15.2 U704.2 108.8,14.2 110,13 U702.2 | v57.68,12.62 U700.2 | v77.2,86.4 77.2,84.11 | 77.2,84.11 U707.1 | U708.1 77.2,76.31 | 77.2,76.31 77.2,84.11 | U709.1 77.2,68.51 | 77.2,68.51 77.2,76.31 | v77.2,63.6 77.2,68.51
  Bottom 0.254: U705.2 94,10 104,10 U704.2 | v116.5,30 118.5,32 139,32 143,36 143,80.54 J700.2 115.66,84.54 113,87.2 78,87.2 v77.2,86.4 | U703.2 55.23,63.6 v77.2,63.6 | U706.2 89.89,21 86.89,18 63.06,18 v57.68,12.62
+3V3  (via drill 0.3)
  Top 0.254: U600.10 120.2,6 | U600.6 120.2,4 | R501.1 106.9,2.9 v106,3.8 107.5,5.3 R600.1
  Top 0.61: 119.9,4 119.7,4 119.3,4.4 119.3,5.4 119.9,6 120.2,6 | 119.9,4 120.2,4 | v117.2,2.8 v117.95,2.8 119.25,1.5 C600.1 119.9,1.55 119.9,4
  other vias: 95.1,4.6 97,4.6 96,4.6
  pour VCC (rank 2): 94.4,0 94.4,8 144,8 144,0
  pour Top: 95.9,6.6 94.8,6.6 94.8,4.3 97.2,4.3 97.2,6.6
+3V3_ENABLE  (via drill 0.3)
  Top 0.254: U3300.5 103,11.5 v103.4,11.1 | U100.59 55.2,23 56.2,22 v58,22
  Bottom 0.254: v103.4,11.1 97.9,11.1 94,15 94,24 89.5,28.5 65.1,28.5 58.6,22 v58,22
+3V3_UPS  (via drill 0.3)
  Top 0.254: U2400.13 13.73,83.08 C2403.1 v14.8,84.6 | U2400.20 8.4,78.05 C2401.1 8.5,78.15 | U2400.30 15.73,75.13 v15.1,74.5 C2402.1 | U100.31 42.5,15.9 41,14.4 C101.1 41.01,12.81 v40.01,12.81 | v51.11,35.41 49.74,35.41 C105.1 U100.80 | v38.2,32.5 38.2,33.6 C104.1 40,33.5 U100.100 | 36.11,27.04 C102.1 | J102.4 v33.7,39.73 | R302.1 30.52,13 v30.41,12.99 | R303.1 v36.3,14.1 | v19,85.8 C2400.1 19.9,85.8 U2500.5 | R202.1 42.14,3.71 v41.99,3.71 41.76,3.71 R201.1 40.75,3 R300.1 | 56.15,14.05 U700.1 54.34,13.9 C700.1 53.15,14.05 v53.11,14.01 | v53.11,12.21 53.15,12.25 R701.1 | R301.1 31.8,3 v31.09,3.71 | v63.91,13.11 R700.1 | v38.4,15.35 37.2,15.35 R100.1 | C102.1 36.55,26.5 U100.10 | R200.1 52.1,2 v52.91,2.81 | U100.61 55.2,24 v55.41,24.21 55.5,24.1 55.59,24.01 56.26,24.01 C103.1 | v35.21,27.91 35.21,27.84 C102.1 | R3202.1 20.67,12.33 v20.8,12.33 | R3201.1 24.67,15.33 v24.7,15.33 | R800.2 v30.25,16.9 | C3010.1 105.55,24.1 U3010.5 | v30.2,24.3 31.25,24.3 C800.1 32.15,23.9 U800.8 | R3203.1 v30.4,27.95
  Top 0.406: C300.1 34.61,12.74 v34.61,13.51 | v44.8,3.7 45.23,4.12 U200.16 46.15,4.08 C200.1
  Top 0.61: U300.2 34.63,11.98 C300.1 | 52.3,49.75 Q2000.4 50.51,49.75 v50.51,48.71 | R2007.2 v52.41,48.71 | v9,14.23 J100.3 | C3010.1 v106.1,23.2 | v117,19 110,19 v109,20 | v9.5,79.4 9.1,79.4 8.35,78.65 C2401.1
  Top 1.27: v70.9,31 68.8,31 67.5,29.7 R3206.2
  Bottom 0.61: v109,20 106.1,22.9 v106.1,23.2
  other vias: 69.9,31 68.9,31
  pour VCC (rank 6): 144,0 0,0 0,93 144,93
+3V3_USBHUB_VCC_A  (via drill 0.3)
  Top 0.254: U2000.16 33.17,58.73 33,58.9 | C2005.1 43.25,61.73 | U2000.12 36.47,62 C2007.1 | C2005.1 43.2,61.85 | U2000.1 41.97,61.8 C2005.1 | U2000.7 38.97,62.73 v38.7,63 38.7,63.63 C2006.1 | U2000.19 33.62,57.22 33.4,57
  Top 0.61: v43.6,63.2 43.6,61.8 C2005.1 | v42.8,63.2 v43.6,63.2 | v43.6,63.2 44.2,63.8 FB2000.2 | v32.4,54.9 32.4,56.02 C2008.1 32.45,56.05 33.4,57 | 33,58.9 31.9,60 C2009.1 29.85,61.4 C2011.1 29.6,61.1 v30.7,61.1 | C2007.1 C2010.1 35.2,63.8 v35.2,64.8
  pour VCC (isolate 0.2): 34.5,65 43.2,65 44.5,63.7 44.5,62 36.5,54 32,54 30,56 30,60.5
+3V3_USBHUB_VCC_D  (via drill 0.3)
  Top 0.254: U2000.25 36.47,52.27 35.9,51.7 v33.9,51.7 32.6,51.7 31.95,51.05 R2003.2 | 45.55,55.23 C2003.1 43.49,55.2 U2000.38 42.47,55.23 42.2,55.5 42.2,57.9 42.53,58.23 42.54,58.22 U2000.44 | 40.97,51.25 C2004.1 | C2004.1 41,50.9 | v42,51.1 42.95,50.15 R2002.1 | U2000.34 41,53.19 C2004.1
  Top 0.61: FB2000.1 v47.35,62.8 v47.35,61.8 | v45.6,54.2 45.6,55.2 C2003.1 | v42,51.1 41,51.1 C2004.1 | v46.7,50.7 Q2000.2 Q2000.3 v46.7,49.75 v46.7,50.7
  pour VCC: 45.1,64.3 45.1,61.8 36.8,53.5 33,53.5 33,52.2 34.3,50.9 44,50.9 45.1,49.9 45.5,49.5 47.5,49.5 49,51 49,64.4 48,65.4 46.2,65.4
+5V_UPS  (via drill 0.3)
  Top 0.254: 22.6,54.45 R2100.2 | 78.8,86.4 78.8,84.11 | 78.8,84.11 U707.8 | U708.8 78.8,76.31 | 78.8,76.31 78.8,84.11 | U709.8 78.8,68.51 78.8,76.31
  Top 0.305: 22.6,54.45 v23.6,54.45 | R2300.2 27.9,40.55 v26.9,40.55
  Top 0.406: Q1000.4 52,45.95 R1000.2 | v26.5,46.55 27.5,46.55 R2200.2
  Top 0.61: v26.5,46.55 Q2200.4 v24.1,46.55 | Q2300.4 v26.9,40.55 v24.55,40.55 | v23.6,54.45 Q2100.4 v25.9,54.45 | Q1000.4 53.7,45.95 | v120,34 119,33 110,33 108,31 | U701.3 111.4,27.6 108,31 | J700.1 118.2,82 113,87.2 79.6,87.2 78.8,86.4 | 108,31 75,31 74.15,30.15 R3106.2
  Top 1.27: C3200.1 66.11,19.06 U3200.3 67.61,21.61 70.3,24.3 70.3,27.1 v70.8,27.6 R3106.2
  VCC 0.61: U705.3 95.6,10 105.6,10 U704.3
  Bottom 0.61: v120,34 121,33 139,33 142,36 142,79 J700.1 | U706.3 90.8,18.9 90.8,7.6 U705.3 | U704.3 109.5,12.6 U702.3 111,15.1 111,26.1 U701.3 | v50.8,45.4 49.1,47.1 U703.3
  other vias: 50.8,44.4 50.8,43.4 72.8,27.6 71.8,27.6 27.5,38.8 28.5,38.8 23.5,38.8 24.5,38.8 19.5,38.8 20.5,38.8
  pour Top (isolate 0.3): 18.8,40 18.8,37.2 29.2,37.3 29.2,41 24,41 24,40
  pour VCC (isolate 0.15): 26,55 33,48 49,48 59.2,37.8 59.2,34.3 63.5,30 74,30 75,29 75,26 74,25 63,25 47,41 32,41 29,38 20,38 19,39 19,51 23,55
  pour Top: 51.6,45 52.4,45 52.4,45.8 54.7,45.8 54.7,46.5 54.3,46.9 51,46.9 50.2,46.1 50.2,43.1 50.5,42.8 51,42.8 51.4,43.2 51.4,44.8
  pour Top (isolate 0.3): 18.8,39.6 18.8,37.2 29.2,37.3 29.2,40.6 24,40.6 24,39.6
+12V_ENABLE
  Top 0.254: U3400.5 79,8 75,4 69,4 67,6 67,12 63.1,15.9 57.8,15.9 56.9,16.8 56.9,20.6 55,22.5 U100.58
+12V_STEPDOWN
  pour Top (rank 2): 81,11.3 73,11.3 73,12.1 71.61,12.1 71.6,13.4 74.81,13.4 75.8,14.4 75.8,16.2 81,16.2
AREF
  Top 0.254: U100.98 41,34.85 C106.1
BACKLIGHT_CONTROL  (via drill 0.3)
  Top 0.254: U500.3 123.55,26.95 v123.5,27 | U100.39 46.5,19.6 v48,21.1
  Bottom 0.254: v48,21.1 51.1,21.1 62,32 113,32 118,27 v123.5,27
BL_OUT+
  Top 0.61: 122.1,31.4 133.1,31.4 136,28.5 136,20.7 J400.6
  pour Top (isolate 0.3): 122.7,31.7 122.7,26.2 118.7,26.2 118.7,29.7 120.7,31.7
BL_OUT-
  Top 0.61: L500.2 132.75,28.15 134.7,26.2 134.7,19.46 J400.5
  pour Top (isolate 0.3): 132.6,27.6 123.3,27.6 123.3,30.7 132.6,30.7
BL_SW
  pour Top (isolate 0.3): 123.5,21 123.5,25.3 125,25.3 125,24.4 132.3,24.4 132.3,21
BST_+5V
  pour Top (no thermals): 103.7,13.2 106.3,13.2 106.3,11.8 104.3,11.8 103.7,12.4
BST_+5V_UPS
  pour Top (no thermals): 81.2,20.3 81.2,17.7 79.8,17.7 79.8,19.7 80.4,20.3
BST_+12V
  pour Top (no thermals): 81.2,7.3 81.2,4.7 79.8,4.7 79.8,6.7 80.4,7.3
DD[1]_N
  Top 0.34: J2101.2 42.65,70.95 42.2,70.95 arc45 40.67,70.32 40.47,70.13 arc45 39.97,68.91 39.97,68 arc90 40.34,67.63 arc-90 40.71,67.26 40.71,65.98 arc-90 40.34,65.61 arc90 39.97,65.24 U2000.5
DD[1]_P
  Top 0.34: J2101.3 42.65,71.44 42.13,71.44 arc45 40.37,70.71 40.13,70.47 arc45 39.47,68.89 U2000.6
DD[2]_N
  Top 0.34: U2000.9 37.97,62.56 arc45 37.67,63.27 arc-45 37.34,64.07 37.34,74.16 arc-45 38.08,75.93 arc-90 38.58,75.93 38.58,75.93 arc90 39.09,75.93 39.87,76.71 arc90 39.87,77.21 39.87,77.22 arc-90 39.87,77.72 40.17,78.02 arc-45 41.94,78.75 42.65,78.75 J2102.2
DD[2]_P
  Top 0.34: U2000.10 37.47,62.58 arc45 37.33,62.93 37.26,63 arc-45 36.85,63.97 36.85,74.37 arc-45 37.59,76.13 39.97,78.51 arc-45 41.73,79.25 42.65,79.25 J2102.3
DD[3]_N
  Top 0.34: U2000.17 26.06,58.22 arc-45 24.29,58.95 18.46,64.78 arc-45 17.73,66.55 17.73,72 arc-90 18.1,72.37 arc90 18.47,72.74 18.47,74.11 arc90 18.1,74.48 arc-90 17.73,74.85 U2400.34
DD[3]_P
  Top 0.34: U2000.18 25.87,57.72 arc-45 24.1,58.45 17.96,64.59 arc-45 17.23,66.36 U2400.33
DTR  (via drill 0.3)
  Top 0.254: C100.1 v12.6,26.7 | v11,23.5 10.52,23.02 J100.6
  Bottom 0.254: v12.6,26.7 12,26.7 11,25.7 v11,23.5
DU_N
  Top 0.34: U1000.PP23 77.44,60.5 77.44,57.13 arc-45 76.71,55.37 74.83,53.49 arc-45 73.07,52.76 56.53,52.76 arc-45 54.77,53.49 51.79,56.47 arc-45 51.05,58.23 51.05,61.26 arc45 50.32,63.03 48.33,65.02 arc45 46.56,65.75 44.14,65.75 arc45 42.37,65.02 41.7,64.36 arc45 40.97,62.59 U2000.3
DU_P
  Top 0.34: U1000.PP22 76.34,61.12 76.95,60.5 76.95,57.34 arc-45 76.22,55.57 74.63,53.98 arc-45 72.86,53.24 56.74,53.24 arc-45 54.97,53.98 52.28,56.67 arc-45 51.55,58.44 51.55,61.47 arc45 50.81,63.23 48.53,65.51 arc45 46.77,66.25 43.93,66.25 arc45 42.17,65.51 41.2,64.55 arc45 40.47,62.78 U2000.4
EEPROM_!CS
  Top 0.254: U100.25 37.3,19 34,15.7 R800.1 32.15,16 U800.1
EEPROM_!HOLD
  Top 0.254: U100.15 33.2,24 32.88,23.68 U800.7
EEPROM_!WP
  Top 0.254: U100.23 34.1,20 33.52,19.42 U800.3
FL_OUT+
  Top 0.61: 120.8,18.6 133.02,18.6 J400.4
  pour Top (isolate 0.3): 121.7,19.1 121.7,13.2 117.7,13.2 117.7,16.6 120.2,19.1
FL_OUT-
  Top 0.61: L400.2 133.93,15.15 J400.3
  pour Top (isolate 0.3): 131.6,14.6 122.3,14.6 122.3,17.6 131.6,17.6
FL_SW
  pour Top (isolate 0.3): 122.5,8 122.5,12.3 124,12.3 124,11.4 131.3,11.4 131.3,8
FRONTLIGHT_CONTROL  (via drill 0.3)
  Top 0.254: U400.3 122.55,13.95 v122.5,14 | U100.40 47,19.1 v47.2,19.3
  Bottom 0.254: v47.2,19.3 52.3,19.3 63,30 73,30 74,31 111,31 115.4,26.6 115.4,22.6 122.5,15.5 v122.5,14
GND  (via drill 0.3)
  Top 0.254: U2000.8 v38.47,60.13 | U2000.2 v41.47,60.17 | U2000.20 v36.33,56.73 | U2000.13 v36.27,60.23 | Y100.2 v43.8,14.8 | U100.32 v43,18.3 | U100.11 v39.3,26 | v49.5,31.7 U100.81 | v52.7,24.5 U100.62 | C103.2 v59.5,24.1 | C105.2 v50,37.9 | C1300.2 114.3,49.15 v114.3,48.2 | v116.8,51.5 116.83,51.48 U1300.5 | U200.13 v44.88,6.17 | U2400.10 15.23,80.97 14.84,81.36 v14.53,81.36
  Top 0.406: C2006.2 38.5,65.87 v38.5,66.8
  Top 0.61: J100.2 J100.1
  other vias: 22.4,77.9 29,72.4 13.13,81.36 11.63,81.36 9.94,77.35 9.94,78.75 11.3,74.5 26.47,61.53 27.07,60.03 33.6,64.8 30.67,54.93 42,49.3 47.2,54.1 46,61.8 37.2,47.6 33.77,60.93 5.5,79.1 11.1,83.7 42.1,11.45 33.4,27.9 36.65,34.55 37.6,35.5 123.8,72.7 123.5,58.1 125.7,58.1 137.5,52.6 137.5,36.1 124.2,39 123.5,35.1 31,5.3 37.65,12.5 122.5,13 125,13 126,13 127,13 128,13 129,13 130,13 131,13 132,13 132,12 132,11 132,10 132,9 132,8 128,7 126,7 127,7 125,7 123,7 124,7 116,13.4 116,12.6 115,11.1 122,7 123.5,26 126,26 127,26 128,26 129,26 130,26 131,26 132,26 133,26 133,25 133,24 133,23 133,22 133,21 131,20 132,20 130,20 129,20 127,20 128,20 126,20 124,20 125,20 117,25.6 116.3,24.1 117,26.4 122.5,5 110.3,5.6 123,1.5 120.1,5 32,66.6 22.4,43.29 23.6,49.39 28.49,33.2 27.49,33.2 27.8,51.61 32,31.9 122.8,51.5 119.1,42 84.6,6.9 84.2,6.3 83.4,6.3 75.8,7.5 74.8,7.5 76.8,7.5 72,6.5 84.6,19.9 84.2,19.3 83.4,19.3 75.8,20.5 74.8,20.5 76.8,20.5 70.8,20.5 104.1,16.6 104.7,16.2 104.7,15.4 103.5,7.8 103.5,6.8 103.5,8.8 104.6,4 23.6,51.69 27.1,51.61 47.8,3.2 51.8,53.5 72.8,16.5 75.9,19.1 60.3,13.3 54.2,16.9 118.2,4.5 33.9,38.49 97.5,22.8 64.5,15.9 66.1,15.8 87.6,7 106.1,27.7 133,20 123,20 20.49,33.2 19.49,33.2 24.49,33.2 23.49,33.2 64.8,49.99 64.8,48.99 64.8,41.99 64.8,40.99 64.8,45.99 64.8,44.99 56.4,43.09 34,43.59 30.4,26.2 71.8,92.35 76.8,92.35 81.8,92.35 86.8,92.35 91.8,92.35 100.8,92.35 105.8,92.35 74.5,50.7 79.5,50.7 84.5,50.7 89.5,50.7 94.5,50.7 99.5,50.7 104.5,50.7 69.5,50.7 67,48.2 72,48.2 69.5,45.7 67,43.2 72,43.2 69.5,40.7 74.5,45.7 79.5,45.7 84.5,45.7 89.5,45.7 94.5,45.7 99.5,45.7 104.5,45.7 77,48.2 82,48.2 87,48.2 92,48.2 97,48.2 102,48.2 77,43.2 82,43.2 87,43.2 92,43.2 97,43.2 102,43.2 74.5,40.7 79.5,40.7 84.5,40.7 89.5,40.7 94.5,40.7 99.5,40.7 104.5,40.7 82,53.2 87,53.2 92,53.2 97,53.2 102,53.2 107,53.2 112,53.2 109.5,55.7 114.5,55.7 79.5,55.7 84.5,55.7 89.5,55.7 94.5,55.7 99.5,55.7 104.5,55.7 82,58.2 87,58.2 92,58.2 97,58.2 102,58.2 84.5,60.7 89.5,60.7 94.5,60.7 99.5,60.7 104.5,60.7 107,58.2 71.8,89.35 76.8,89.35 81.8,89.35 86.8,89.35 91.8,89.35 100.8,89.35 105.8,89.35 109.5,60.7 74.3,90.85 79.3,90.85 84.3,90.85 89.3,90.85 103.3,90.85 53.17,4.47 23,85.9 23.2,90.1 9,11.7 12.1,9.2 35.3,47.4 46.8,51.7 27.3,3.7 104,22.5 103.9,19.7 87.6,20.1 60.3,21.55 116.4,43.8 35.15,18.6 28.8,23 101.5,29.1 100.5,26.9 102.6,27.7 47.2,58 61.5,23.45 62.6,21.65 58.8,20.45 60.2,18.55 50.3,8.4 57.8,11.6 72.6,19 92.8,27.2 106.4,29 71.8,84.55 81.8,84.55 86.8,84.55 91.8,84.55 100.8,84.55 105.8,84.55 71.8,81.55 81.8,81.55 86.8,81.55 91.8,81.55 100.8,81.55 105.8,81.55 74.3,83.05 84.3,83.05 89.3,83.05 103.3,83.05 71.8,68.95 81.8,68.95 86.8,68.95 91.8,68.95 100.8,68.95 105.8,68.95 71.8,65.95 81.8,65.95 86.8,65.95 91.8,65.95 100.8,65.95 105.8,65.95 74.3,67.45 84.3,67.45 89.3,67.45 103.3,67.45 71.8,76.75 81.8,76.75 86.8,76.75 91.8,76.75 100.8,76.75 105.8,76.75 71.8,73.75 81.8,73.75 86.8,73.75 91.8,73.75 100.8,73.75 105.8,73.75 74.3,75.25 84.3,75.25 89.3,75.25 103.3,75.25 129.1,57.25 131.1,57.25 133.1,57.25 129.1,52.25 131.1,52.25 133.1,52.25 129,40.75 131,40.75 133,40.75 129,35.75 131,35.75 133,35.75
  pour GND: 0,0 144,0 144,93 0,93
  pour Top (isolate 0.15, rank 6): -0.06,93.06 144.68,93.06 143.68,-0.36 -0.06,-0.36 0,55.5 4.6,55.5 arc124 10.5,55.5 17,55.5 17,70.6 10.35,70.6 arc124 4.6,70.5 -0.06,70.5
  pour Bottom (isolate 0.15, rank 6): -0.06,93.06 144.68,93.06 143.68,-0.36 -0.06,-0.36 0,55.5 4.6,55.5 arc124 10.5,55.5 17,55.5 17,70.6 10.35,70.6 arc124 4.6,70.5 -0.06,70.5
  cutout Top: 75.6,73.45 75.6,77.05 80.4,77.05 80.4,73.45
  cutout Top: 75.6,81.25 75.6,84.85 80.4,84.85 80.4,81.25
  cutout Top: 75.6,65.65 75.6,69.25 80.4,69.25 80.4,65.65
HVU_+SUPPLY  (via drill 0.3)
  Bottom 1.27: J1.3 4.42,47.58
  Bottom 1.93: 4.42,47.58 6.8,45.2 6.8,21.1 18,9.9 65.4,9.9 67.5,12 v67.5,14.6
  other vias: 67.5,13.6
  pour Top: 67,16 67,13.4 67.3,13.1 67.8,13.1 68.2,13.5 68.2,14.1 70.2,16.1 70.2,16.7 70,16.9 67.9,16.9
HVU_ENABLE
  Top 0.254: U100.12 34.1,25.5 32.5,27.1 19.4,27.1 4,42.5 J1.1
HVU_MEASURE  (via drill 0.3)
  Top 0.254: U100.97 41.5,36 40.9,36.6 36.6,36.6 33.45,33.45 C107.1 33.1,33.4 v31.8,33.4
  Bottom 0.254: v31.8,33.4 30.6,33.4 30,34 20,34 9,45 9,49.6 5.94,52.66 J1.5
HVU_TRIGGER
  Top 0.254: U100.13 32.8,25 32.4,25.4 19.6,25.4 5,40 2.6,40 1,41.6 1,43.34 J1.2
I2C_MUX_RST
  Top 0.254: U200.3 50.33,5.53 | 50.33,5.53 50,5.2 50,2.15 R200.2 | U100.50 52,14.9 49.5,12.4 49.5,6.25 50.33,5.53
I2CMUX_SCL
  Top 0.254: U100.43 48.5,6.8 47.23,5.53 U200.14 41.88,5.53 R201.2
I2CMUX_SDA
  Top 0.254: U100.44 49,6.6 47.27,4.88 U200.15 44,4.88 43.88,4.88 43.33,4.88 R202.2
ISS_VBUS  (via drill 0.3)
  Top 0.254: R3000.2 v22,2 | Q3400.3 70.75,17.45 70.3,17 v70.3,6 | v93.4,4.4 93.6,4.6 93.6,17.3 99.3,23 103,23 103.5,23.5 103.5,24.7 104.45,25.65 U3010.1
  VCC 0.254: v93.4,4.4 93.4,2.1 | v70.3,6 70.3,2
  VCC 0.61: 93.4,2.1 93.3,2 70.3,2 v22,2 16,8 10,8 6,12 6,51 12.26,57.26 J2000.1
  VCC 1.27: 6.7,60.6 7.5,59.9 11.1,59.9 12.26,61.06 J2000.1
  VCC 2.54: J6001.+ 3,64.3 6.7,60.6
M_OUT+  (via drill 0.3)
  Top 0.254: U600.7 122.1,4.5 122.2,4.4 123.2,4.4
  Top 0.61: 123.2,4.4 v124.6,4.4
  VCC 0.61: v124.6,4.4 127.4,4.4 130,1.8 132,1.8 135.2,5 J400.1
M_OUT-  (via drill 0.3)
  Top 0.254: U600.9 122.1,5.5 122.2,5.64 123.3,5.64
  Top 0.61: 123.3,5.64 v124.6,5.64
  VCC 0.61: v124.6,5.64 128.64,5.64 129.5,6.5 137.96,6.5 J400.2
MISO
  Top 0.254: 32.88,20.5 U800.2 | U100.22 32.88,20.5 | 32.88,20.5 27.3,20.5 J101.1
MOSI  (via drill 0.3)
  Top 0.254: U800.5 34.88,23.02 v35.3,22.6 | U100.21 35.5,21 v35.3,21.2
  Bottom 0.254: v35.3,22.6 v35.3,21.2 35.1,21 24.2,21 J101.4
MOT_!EN  (via drill 0.3)
  Top 0.254: v66,5 66,12 62.6,15.4 57.6,15.4 56.4,16.6 56.4,20.4 54.8,22 U100.57 | U600.5 116.2,4 v113.4,1.2
  Bottom 0.254: v66,5 70,1 113.2,1 v113.4,1.2
MOT_SCL
  Top 0.254: U200.5 55.17,6.83 60.4,1.6 106.6,1.6 108.7,3.7 | R600.2 108.7,3.7 | U600.2 115.7,5.5 114.3,4.1 109.1,4.1 108.7,3.7
MOT_SDA
  Top 0.254: U200.4 54.83,6.17 60,1 107.3,1 R501.2 109.4,3.1 114.2,3.1 116.1,5 U600.3
N$1
  Top 0.254: U1000.PP15 110.25,50.17 U1300.7
N$2
  Top 0.254: U1300.9 117.38,48.88 113.2,44.7 113.2,44.3 112.06,43.16 U1000.PP16
N$3
  Top 0.254: U1000.PP14 109.26,45.06 108.1,43.9 108.1,42.6 108.9,41.8 110,41.8 111.3,40.5 112.5,40.5 114.3,42.3 114.3,43.5 117.62,46.83 U1300.12
N$4
  Top 0.254: U1000.PP19 111.48,48 108.8,48 108.1,48.7 108.1,50.1 108.83,50.83 U1300.6
N$5
  Top 0.254: U1000.PP18 107.5,48.5 107.5,50.6 109.03,52.12 U1300.4
N$6
  Top 0.254: U1300.10 117.42,48.23 113.7,44.5 113.7,43.52 U1000.PP17
N$7
  Top 0.254: C3405.1 69.4,18.75 Q3400.4
N$8
  Top 0.254: C3000.1 98.45,28.9 Q3000.4
N$9
  Top 0.254: R1002.1 56.5,32.6 56.9,33 64.36,33 U1000.36
N$10
  pour Top (rank 2): 81,24.3 73,24.3 73,25.1 71.61,25.1 71.6,26.4 74.81,26.4 75.8,27.4 75.8,29.2 81,29.2
N$11
  pour Top (rank 2): 99.7,13 99.7,5 98.9,5 98.9,3.61 97.6,3.6 97.6,6.81 96.6,7.8 94.8,7.8 94.8,13
N$12
  Top 0.61: Q3400.1 72.15,15 R3406.2 74.55,17 C3404.1
N$13
  Top 0.61: Q3000.1 94.45,24.1 C3001.1 94.1,24.5 R3006.2
N$14
  Top 0.254: R1004.1 57,29 60,32 65,32 66,33 97.38,33 U1000.10
N$15
  Top 0.254: R1003.1 58.7,29 61.1,31.4 65.4,31.4 66,32 98.92,32 U1000.8
N$16
  Bottom 1.27: CHASSIS.P$1 7.55,83.55 J2000.SHIELD_1 J2000.SHIELD_2
N$17
  Top 0.254: Q3000.3 100.5,24.1 R3010.2 102.55,24.05 U3010.4
N$18
  Top 0.254: Q2100.6 22.5,52.55 R2100.1
N$19
  Top 0.254: R2001.2 45,56.4 44.33,55.73 U2000.39
N$21
  Top 0.254: C2000.1 29.4,65.13 | 29.4,65.1 29.4,65.13 | 29.4,65.13 Y2000.1 29.27,64.23 33.77,59.73 U2000.14
N$22
  Top 0.254: U2000.15 33.67,59.23 30.3,62.6 29.4,62.6 23.6,68.3 23.6,70.7 Y2000.2 21.2,73.2 21.2,75.2 C2001.1
N$23
  Top 0.254: U2000.24 33.43,54.73 32.35,53.65 R2006.2
N$24
  Top 0.254: U2000.33 40.47,52.27 39.45,51.25 R2005.2
N$25
  Top 0.254: U2000.11 36.97,62.63 36.4,63.2 36.4,64.8 35,66.2 R2000.2
N$26
  Top 0.254: U2000.37 43.6,54.73 43.6,53.25 R2002.2
N$28  (via drill 0.3)
  Top 0.254: v141,75 141,73.05
  Top 0.61: U300.6 v33.37,6.7
  Top 1.016: XBT300.+ 141,73.05
  VCC 0.254: v4,8 0.6,11.4 0.6,85.6 5,90 9.5,90 12.2,92.7 48.3,92.7 53,88 128,88 v141,75
  Bottom 0.254: v4,8 32.06,8 v33.37,6.7
N$29
  Top 0.254: U600.1 115.2,6
  Top 0.61: 115.2,6 113.4,6 113.35,5.95 C601.1
N$30
  Top 0.254: U100.33 43.5,15.4 42.6,14.5 Y100.1
N$31
  Top 0.254: U100.34 44,15.5 45,14.5 Y100.3
OUT
  Top 1.27: C3202.1 61.6,19.15 C3201.1 U3200.2 U3200.4 63.8,27.75 R3206.1
PSU_CHRG_OK  (via drill 0.3)
  Top 0.254: 20.2,28.5 v20,28.3 21.7,30 31.15,30 | v8.7,28.5 8.2,29 J6000.1 | U100.6 33.5,28.5 32,30 31.15,30 | R3203.2 31.15,30
  Bottom 0.254: v20,28.3 19.8,28.5 v8.7,28.5
PSU_SMBC
  Top 0.254: U200.10 27.88,8.12 21.2,14.8 | 21.2,14.8 10.3,25.7 10.3,29.7 8.46,31.54 J6000.2 | R3202.2 21.2,14.8
PSU_SMBD
  Top 0.254: U200.9 28.12,8.88 23.7,13.3 | 23.7,13.3 11,26 11,30 6.92,34.08 J6000.3 | R3201.2 23.7,13.3
R1/C1
  Top 0.254: Q1100.6 119.6,59.05 R1101.1
R1/C2
  Top 0.254: Q1200.6 119.6,36.05 R1201.1
R1/C3
  Top 0.254: R2007.1 52.3,51.65 Q2000.6
R1/C4
  Top 0.305: Q2200.6 27.4,48.45 R2200.1
R1/C5
  Top 0.254: Q2300.6 27.4,42.45 R2300.1
R1/C6
  Top 0.406: Q1000.6 52,44.05 R1000.1
RESET  (via drill 0.3)
  Top 0.254: U100.30 42,18.2 v41.7,18.5 38.25,18.5 37.3,17.55 R100.2 36.65,17.25 34.2,14.8 28.6,14.8 26,17.4 23.4,17.4 21.7,19.1 21.7,21.02 J101.5 16.02,26.7 C100.2 | v34,41 J102.6
  Bottom 0.254: v41.7,18.5 41.7,27.3 35,34 35,40 v34,41
RTC_32KHZ
  Top 0.254: U100.29 41.5,15.7 39.9,14.1 R303.2 39,12.7 37,10.7 U300.1
RTC_!INT  (via drill 0.3)
  Top 0.254: v49.5,18.3 U100.45 | U300.3 33.37,12.79 R302.2 v33.15,14
  Bottom 0.254: v33.15,14 33.15,14.05 36.1,17 48.2,17 v49.5,18.3
RTC_SCL
  Top 0.254: U200.12 37.43,6.83 U300.8 35.91,3.14 R300.2
RTC_SDA
  Top 0.254: U200.11 36.48,7.47 36,7 35,7 34.63,6.63 U300.7 34.63,3.18 R301.2
RXD0  (via drill 0.3)
  Top 0.254: v35,31.2 35.2,31 36,31 36.5,30.5 U100.2 | J100.4 11.77,16.77 v13,18
  Bottom 0.254: v35,31.2 34.8,31 25,31 13,19 v13,18
SCK
  Top 0.254: U800.6 33.52,21.82 | 33.52,21.82 28.48,21.82 26.6,23.7 24.3,23.7 22.96,22.36 J101.3 | U100.20 37.1,21.5 36.78,21.82 33.52,21.82
SCU_3V3_OUT  (via drill 0.3)
  Top 0.254: U1300.8 116.28,49.52 C1300.1 115.7,48.95 v115.7,48.2 | Q1100.4 119.6,60.95 | Q1200.4 119.6,37.95
  Top 0.61: 119.6,60.95 R1101.2 | 119.6,37.95 R1201.2 | C1400.1 U1400.5 v118.2,39.7 v121.2,39.7 v121.2,38.9 121.2,37.95 Q1200.4 | v121.2,62.7 v121.2,61.9 121.2,60.95 Q1100.4
  pour VCC (isolate 0.3): 88.5,37 88.5,40.1 121.5,64.1 124,64 124,37
SCU_5V_IN  (via drill 0.3)
  Top 1.27: v63.6,55.9 v63,55.3
  Top 2.54: U1000.PP1 64.64,56.94 v63.6,55.9
  Bottom 2.54: v59.2,41.1 v59.2,42 59.2,51.52 U1000.PP1
  other vias: 59.2,46 59.2,45.1 59.2,50 59.2,49.1
  pour Top (isolate 0.3): 59,40.9 60.9,40.9 60.8,50.2 58.6,50.2 55.4,47.1 55.4,44.8 57.6,44.8 59,43.4
SCU_PWR
  Top 0.254: 54.3,45 Q1000.5 54.35,45 54.75,44.6 54.75,42 R1001.2 52,38.95 U100.76
SCU_RXD0
  Top 0.254: U100.64 57.35,25.5 R1004.2
SCU_SD_!TOGGLE  (via drill 0.3)
  Top 0.254: Q1100.5 121.95,60 122.25,59.7 122.25,57.6 R1100.2 v120,57 | U1400.4 118.2,44.2 v120,46
  Bottom 0.254: v120,46 v120,57
SCU_SD_TOGGLE  (via drill 0.3)
  Top 0.254: R1200.2 122.3,34.6 122.3,37 | U1400.2 122.3,42 | U1300.24 123.17,54.17 122.2,53.2 122.2,47.7 v122.3,47.6 122.33,47.58 U1300.14 | 122.3,37 122.3,42 | Q1200.5 122.3,37 | 122.3,42 v122.3,44.5 | U100.74 56,30.5 v56.5,30.5
  Bottom 0.254: v122.3,47.6 v122.3,44.5 120,42.2 120,36 117,33 59,33 v56.5,30.5
SCU_SHUTDOWN_REQUEST
  Top 0.254: U100.75 54,31.85 R1002.2
SCU_TXD0
  Top 0.254: R1003.2 57.85,25 U100.63
SD-1_CD/DAT3
  Top 0.254: U1300.1 118.42,54.17 119.25,55 135,55 137,57.01 XU1100.2
SD-1_CLK
  Top 0.254: U1300.22 124.78,52.77 126,54 138.4,54 138.69,53.7 XU1100.5
SD-1_CMD
  Top 0.254: U1300.23 124.62,53.42 125.7,54.5 136,54.5 137.41,55.91 XU1100.3
SD-1_DAT0
  Top 0.254: U1300.21 124.83,52.12 126.2,53.5 135,53.5 137,51.51 XU1100.7
SD-1_DAT1
  Top 0.254: U1300.19 124.62,50.83 126.8,53 134.5,53 137.04,50.45 XU1100.8
SD-1_DAT2
  Top 0.254: U1300.2 117.28,53.42 116.9,53.8 116.9,54.7 117.7,55.5 134.2,55.5 136.81,58.1 XU1100.1
SD-2_CD/DAT3
  Top 0.254: U1300.13 124.58,46.83 125.4,46 139.5,46 140.5,45 140.5,41.5 139.5,40.51 XU1200.2
SD-2_CLK
  Top 0.254: U1300.16 124.58,48.88 126.45,47 140.5,47 141.5,46 141.5,38.5 140.21,37.2 XU1200.5
SD-2_CMD
  Top 0.254: U1300.15 124.58,48.23 126.3,46.5 140,46.5 141,45.5 141,41 139.41,39.41 XU1200.3
SD-2_DAT0
  Top 0.254: U1300.17 124.58,49.52 126.6,47.5 141,47.5 142,46.5 142,37.25 139.75,35.01 XU1200.7
SD-2_DAT1
  Top 0.254: U1300.18 124.58,50.17 126.75,48 141.5,48 142.5,47 142.5,36.5 139.96,33.95 XU1200.8
SD-2_DAT2
  Top 0.254: U1300.11 121.03,47.58 123.1,45.5 139,45.5 140,44.5 140,42.1 139.5,41.6 XU1200.1
SD-I_3V3
  Top 0.61: XU1100.4 139.4,54.8 139.9,55 | Q1100.2 Q1100.3 C1100.1 126.25,60.95 127,61.7
  Top 1.27: 127,61.7 128.4,63.1 138.9,63.1 141.4,60.6 141.4,56.5 139.9,55
SD-II_3V3
  Top 0.61: Q1200.3 Q1200.2 124.85,37 C1200.1 126.15,37.15 127,38 | XU1200.4 137.5,38.3
  Top 1.27: 126.5,37.5 127,38 127.3,38.3 137.5,38.3
SW_+5V  (via drill 0.3)
  other vias: 103.3,14.5 102.7,14.5 103.3,13.9 102.7,13.9 98.7,16.2 98,16.2 97.3,16.2 96.6,16.2 102.7,16.6 103.3,16.6
  pour Bottom (no thermals): 98.9,16.4 98.9,15.9 100.1,14.7 101.5,14.7 102.5,15.7 102.5,16.8 103.5,16.8 103.5,12.7 98.6,12.7 95.9,15.4 95.9,16.4
  pour Top (no thermals): 99,18.5 99,15.8 100.1,14.7 102.5,14.7 102.5,16.8 103.5,16.8 103.5,14.7 106.3,14.7 106.3,13.7 97.6,13.7 95.7,15.6 95.7,18.5
SW_+5V_UPS  (via drill 0.3)
  other vias: 82.5,20.7 82.5,21.3 81.9,20.7 81.9,21.3 84.2,25.3 84.2,26 84.2,26.7 84.2,27.4 84.6,21.3 84.6,20.7
  pour Bottom (no thermals): 84.4,25.1 83.9,25.1 82.7,23.9 82.7,22.5 83.7,21.5 84.8,21.5 84.8,20.5 80.7,20.5 80.7,25.4 83.4,28.1 84.4,28.1
  pour Top (no thermals): 86.5,25 83.8,25 82.7,23.9 82.7,21.5 84.8,21.5 84.8,20.5 82.7,20.5 82.7,17.7 81.7,17.7 81.7,26.4 83.6,28.3 86.5,28.3
SW_+12V  (via drill 0.3)
  other vias: 82.5,7.7 82.5,8.3 81.9,7.7 81.9,8.3 84.2,12.3 84.2,13 84.2,13.7 84.2,14.4 84.6,8.3 84.6,7.7
  pour Bottom (no thermals): 84.4,12.1 83.9,12.1 82.7,10.9 82.7,9.5 83.7,8.5 84.8,8.5 84.8,7.5 80.7,7.5 80.7,12.4 83.4,15.1 84.4,15.1
  pour Top (no thermals): 86.5,12 83.8,12 82.7,10.9 82.7,8.5 84.8,8.5 84.8,7.5 82.7,7.5 82.7,4.7 81.7,4.7 81.7,13.4 83.6,15.3 86.5,15.3
TCK
  Top 0.254: U100.93 43.5,35.5 40.54,38.46 J102.1
TDI
  Top 0.254: U100.90 45,37.5 38.96,43.54 J102.9
TDO  (via drill 0.3)
  Top 0.254: U100.91 44.5,36.5 39,42 v38,42 | v38,40 37.77,39.73 J102.3
  Bottom 0.254: v38,42 v38,40
TEMP_SCL
  Top 0.254: R701.2 54.85,10.1 U700.4 54.33,8.12 U200.7
TEMP_SDA
  Top 0.254: R700.2 63.75,10.1 U700.5 59.09,10.1 56.48,7.47 U200.6
TMS
  Top 0.254: J102.5 39,41 44,36 U100.92
TXD0  (via drill 0.3)
  Top 0.254: U100.3 35.2,30 v35,30.2 | J100.5 14.41,19.31 14.6,19.5 v14.8,19.5
  Bottom 0.254: v35,30.2 34.8,30 25,30 14.8,19.8 v14.8,19.5
USB-A_5V  (via drill 0.3)
  Top 0.61: v28.5,53.5 Q2100.2 Q2100.3 v28.5,54.45
  Bottom 1.016: J2101.1 41.8,69.1
  Bottom 1.27: v28.5,53.5 28.5,65.7 31.9,69.1 41.8,69.1
USB-A_PWR
  Top 0.254: U100.87 46.5,38.7 39.7,45.5 33.6,45.5 29.8,49.3 27.05,49.3 26.35,50 R2101.2
  Top 0.305: Q2100.5 25.6,53.5 26,53.1 26,50.65 R2101.2
USB-B_5V  (via drill 0.3)
  Top 0.61: v21.6,47.5 Q2200.2 Q2200.3 v21.6,46.55
  Bottom 1.016: J2102.1 41.8,76.9
  Bottom 1.27: v21.6,46.55 v21.6,47.5 21.6,67.6 30.9,76.9 41.8,76.9
USB-B_PWR
  Top 0.254: U100.88 46,38.5 39.5,45 33.4,45 30.9,47.5 Q2200.5 24.6,47.5 24.2,47.9 24.2,49.75 R2201.2
USB-X_5V  (via drill 0.3)
  Top 0.61: v22.1,40.55 Q2300.3 Q2300.2 v22.1,41.5
  Bottom 1.016: 41.8,84.7 J2103.1
  Bottom 1.27: v22.1,40.55 v22.1,41.5 19.5,44.1 19.5,72.5 31.7,84.7 41.8,84.7
USB-X_!PWR  (via drill 0.3)
  Top 0.254: U2400.6 17.23,80.93 17.6,81.3 v17.9,81.3 | v19.7,89.1 19.7,90.05 U2500.4
  Bottom 0.254: v19.7,89.1 19.7,83.1 v17.9,81.3
USB-X_PWR  (via drill 0.3)
  Top 0.254: U100.89 45.5,38.3 39.3,44.5 R2301.2 23.25,45.5 v17.5,45.5 | U2500.2 v21,89.1
  Top 0.305: Q2300.5 24.9,41.5 24.5,41.9 24.5,44.35 R2301.2
  Bottom 0.254: v21,89.1 21,77 17.7,73.7 17.7,45.7 v17.5,45.5
USB-X_TOGGLE  (via drill 0.3)
  Top 0.254: v16,54 16,34 19,31 32,31 34,29 U100.5 | v15.4,81.7 15.73,81.37 U2400.9
  Bottom 0.254: v15.4,81.7 17.1,80 19.7,80 20.2,79.5 20.2,77.2 17,74 17,55 v16,54
USBHUB_!RESET
  Top 0.254: U2000.26 36.97,50.36 R2004.2 | R2003.1 35.25,50.3 C2002.1 35.37,50.34 36.99,50.34 R2004.2 | U100.85 47.5,39.84 38.2,49.14 38.2,49.9 37.75,50.35 R2004.2
USBHUB_PORT-1
  Top 0.254: R2006.1 30.65,49.35 34,46 40,46 47,39 U100.86
USBHUB_PORT-2
  Top 0.254: R2005.1 39.4,48.7 48,40.1 U100.84
USBHUB_PWR
  Top 0.254: R2008.2 49.15,51.05 49.5,50.7 | 49.5,50.7 Q2000.5 | U100.83 48.5,38 49.1,38.6 49.1,50.3 49.5,50.7
USBISS_D_N
  Top 0.34: U2400.32 16.73,74.42 arc-45 16,72.65 12.17,68.83 arc45 11.49,67.19 11.49,64.95 J2000.2
USBISS_D_P
  Top 0.34: U2400.31 16.23,74.61 arc-45 15.5,72.84 15.38,72.72 arc-90 14.87,72.72 14.77,72.83 arc90 14.27,72.83 13.23,71.78 arc90 13.23,71.28 13.33,71.18 arc-90 13.33,70.67 11.74,69.08 arc45 11.01,67.32 11.01,64.92 J2000.3
USBX_D_N
  Top 0.34: U2400.7 16.73,81.06 arc-45 17.1,81.95 17.43,82.28 arc-45 18.33,82.66 21.97,82.66 arc45 23.73,83.39 26.17,85.82 arc-45 27.94,86.56 38.8,86.56 arc-90 39.16,86.2 arc90 39.52,85.84 41.09,85.84 arc90 41.45,86.2 arc-90 41.81,86.56 42.65,86.56 J2103.2
USBX_D_P
  Top 0.34: U2400.8 16.23,81.25 arc-45 16.6,82.15 17.23,82.77 arc-45 18.12,83.14 21.76,83.14 arc45 23.53,83.88 25.97,86.31 arc-45 27.73,87.05 42.65,87.05 J2103.3
VFB_+5V
  Top 0.254: R3301.2 R3300.1 100.4,4.15 100.4,10.4 102.05,12.05 U3300.4
  pour Top (isolate 0.3, no thermals): 102.2,13.1 100.3,13.1 100.3,9.4 102.2,9.4
VFB_+5V_UPS
  Top 0.254: R3101.2 R3100.1 72.15,23.6 78.2,23.6
  pour Top (isolate 0.3, no thermals): 81.1,21.8 81.1,23.7 77.4,23.7 77.4,21.8
VFB_+12V
  Top 0.254: 72.45,9.25 R3401.2 R3400.1 72.15,10.6 77.8,10.6
  pour Top (isolate 0.3, no thermals): 81.1,8.8 81.1,10.7 77.4,10.7 77.4,8.8
VSYS  (via drill 0.3)
  other vias: 114,21.2 114,22.1 114,23.1 113,8.2 113,9.1 113,10.1 84.2,9.7 83.4,9.7 84.6,9.1 101.3,16.2 101.3,15.4 101.9,16.6 96.5,27.6 96.5,28.6 96.5,29.6
  pour Top (isolate 0.3, rank 3): 122.5,21 122.5,25.4 118.7,25.4 118.7,23.3 113.8,23.3 113.8,21
  pour Top (isolate 0.3, rank 3): 121.5,8 121.5,12.4 117.7,12.4 117.7,10.3 112.8,10.3 112.8,8
  pour Top (rank 5, no thermals): 82.1,8.6 89.9,8.6 89.9,11.9 82.1,11.9
  pour Bottom (rank 5, no thermals): 82.1,8.6 89.9,8.6 89.9,11.9 82.1,11.9
  pour Bottom (rank 5, no thermals): 102.4,14.1 102.4,21.9 99.1,21.9 99.1,14.1
  pour Top (rank 5, no thermals): 102.4,14.1 102.4,21.9 99.1,21.9 99.1,14.1
  pour Top: 95.7,25.7 95.7,30 97.7,30 97.7,25.7
  pour VCC: 111,31 96,31 83,19 83,8 113.5,8 115,9.2 115,27
VSYS_ENABLE  (via drill 0.3)
  Top 0.254: v102.8,25.4 103.5,26.1 U3010.2 103.5,29 R3011.2 | U100.60 55.4,23.5 55.9,23 v58,23
  Bottom 0.254: v102.8,25.4 93.6,25.4 89.8,29.2 63.6,29.2 58,23.6 v58,23
VSYS_UPS  (via drill 0.3)
  VCC 2.54: v87.7,22.9 87.7,24.7 95,32 135.5,32 J6002.+
  other vias: 84.2,22.7 83.4,22.7 84.6,22.1 87.7,24.5 87.7,23.7
  pour Top (rank 5, no thermals): 82.1,21.6 89.9,21.6 89.9,24.9 82.1,24.9
  pour Bottom (rank 5, no thermals): 82.1,21.6 89.9,21.6 89.9,24.9 82.1,24.9

## Text on the board
tPlace: USB-X | USB-B | USB-A | SCU_SD_TOGGLE: low | SCU_SD_TOGGLE: high | EXCISS Mainboard / v1.2 David Merges
bPlace: Mainboard | Hard- & Softwareteam / / Shintaro Fujita / Rainer Haseitl / Günter Helbig / Jochen Kerscher / Lutz Lisseck / Solveigh Matthies / David Merges / Leandra Schneider | HACKERSPACE FFM